# EAGLE design DigitalBackend_v1 (EAGLE 9.6.2)

## Sheet 1 of 6: MAIN
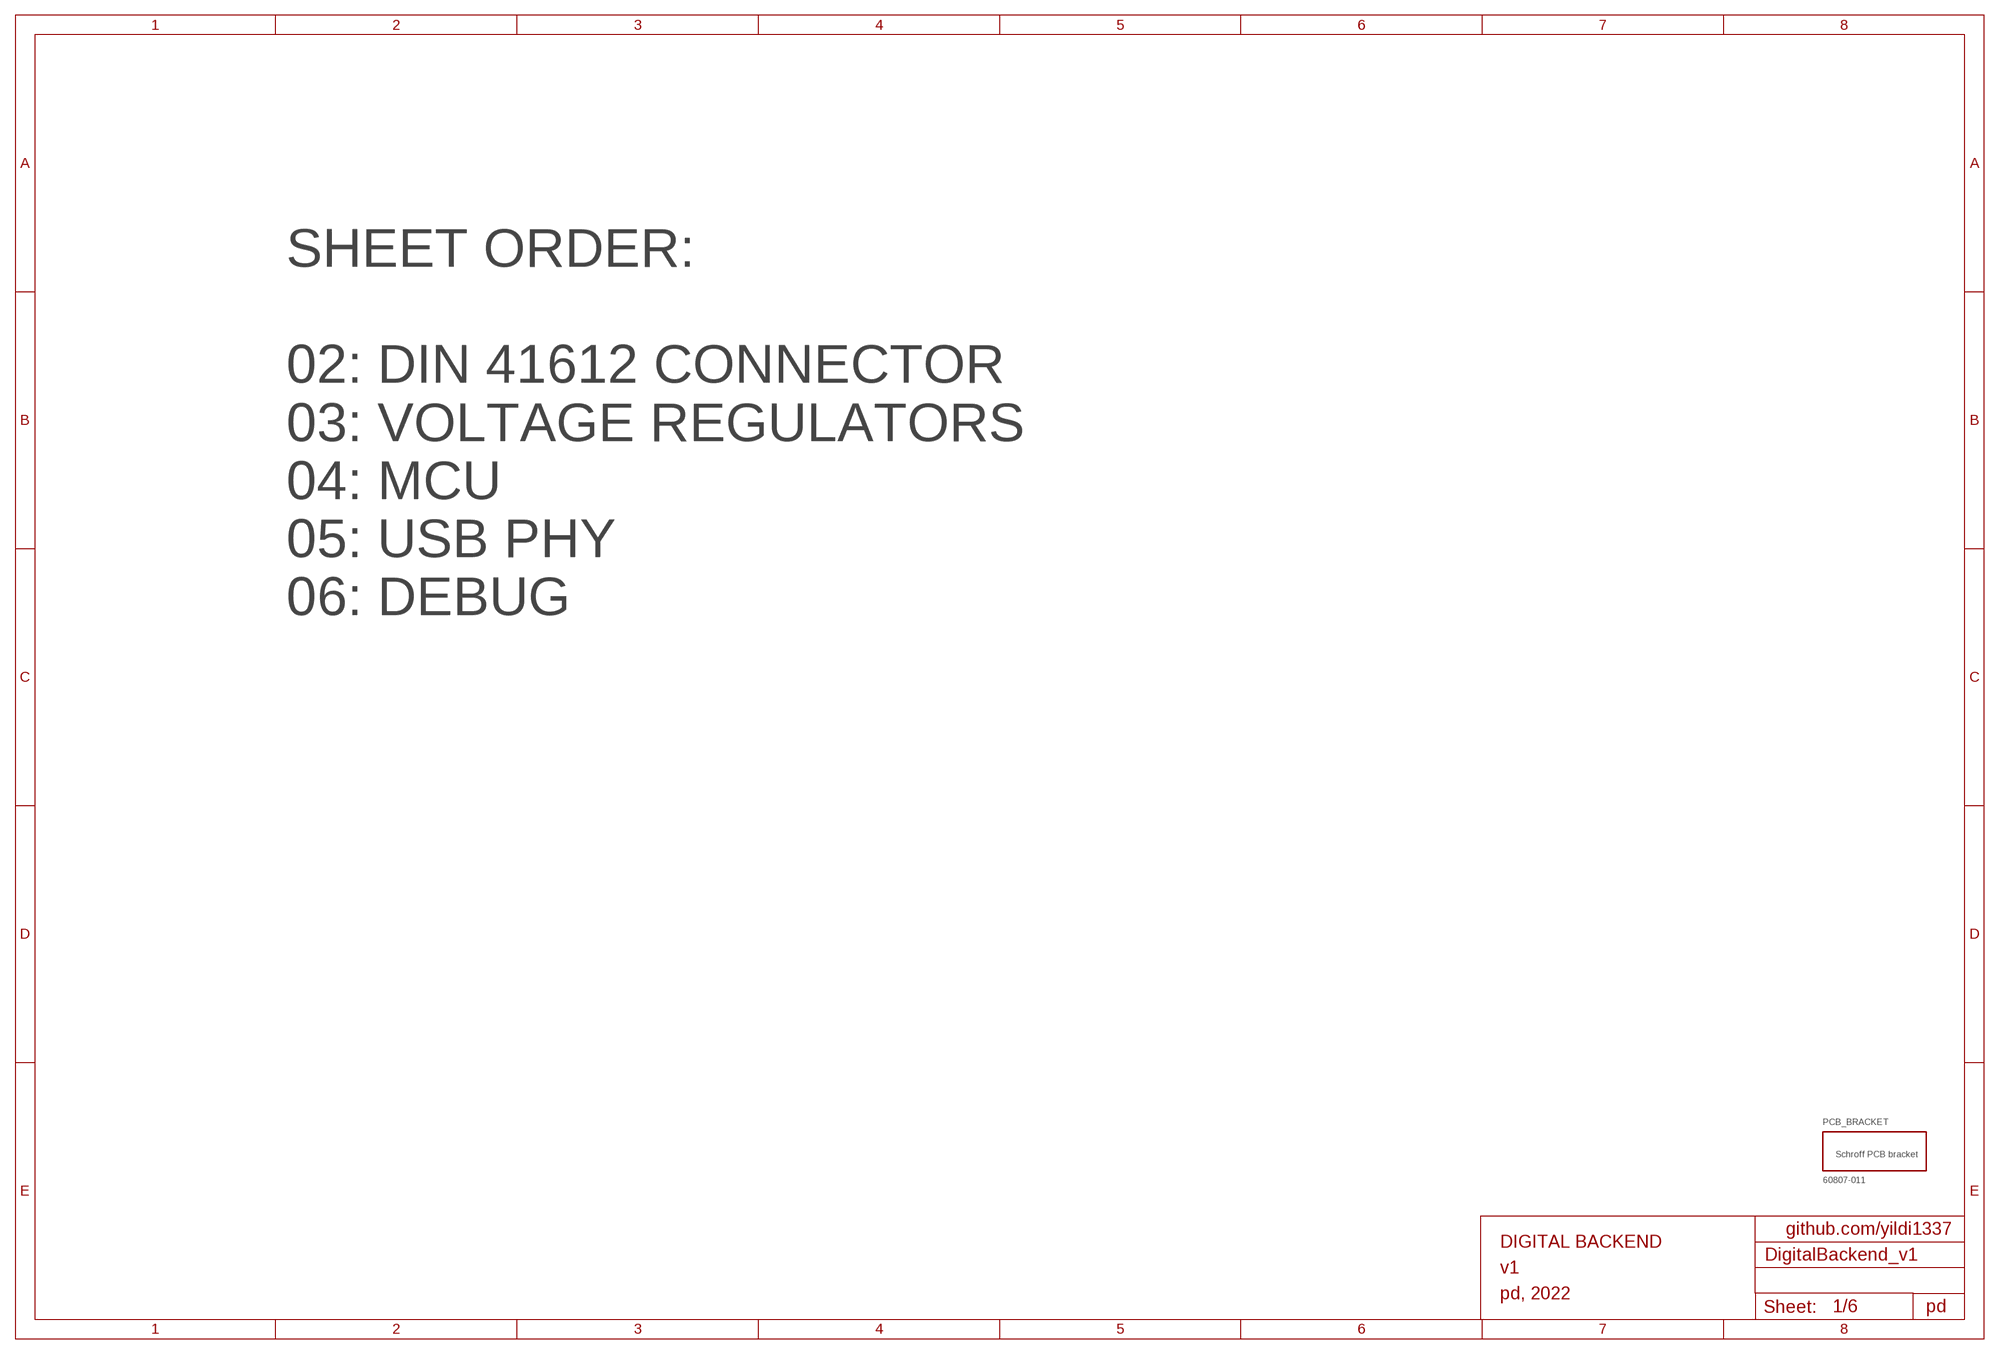
[diagram p0: schematic, sheet 1]

### Parts
PCB_BRACKET  60807-011  [60807-011]

### Notes on the sheet
- SHEET ORDER:
  
  02: DIN 41612 CONNECTOR
  03: VOLTAGE REGULATORS
  04: MCU
  05: USB PHY
  06: DEBUG
- github.com/yildi1337
- DIGITAL BACKEND
- v1
- pd, 2022
- pd

## Sheet 2 of 6: DIN 41612 CONNECTOR
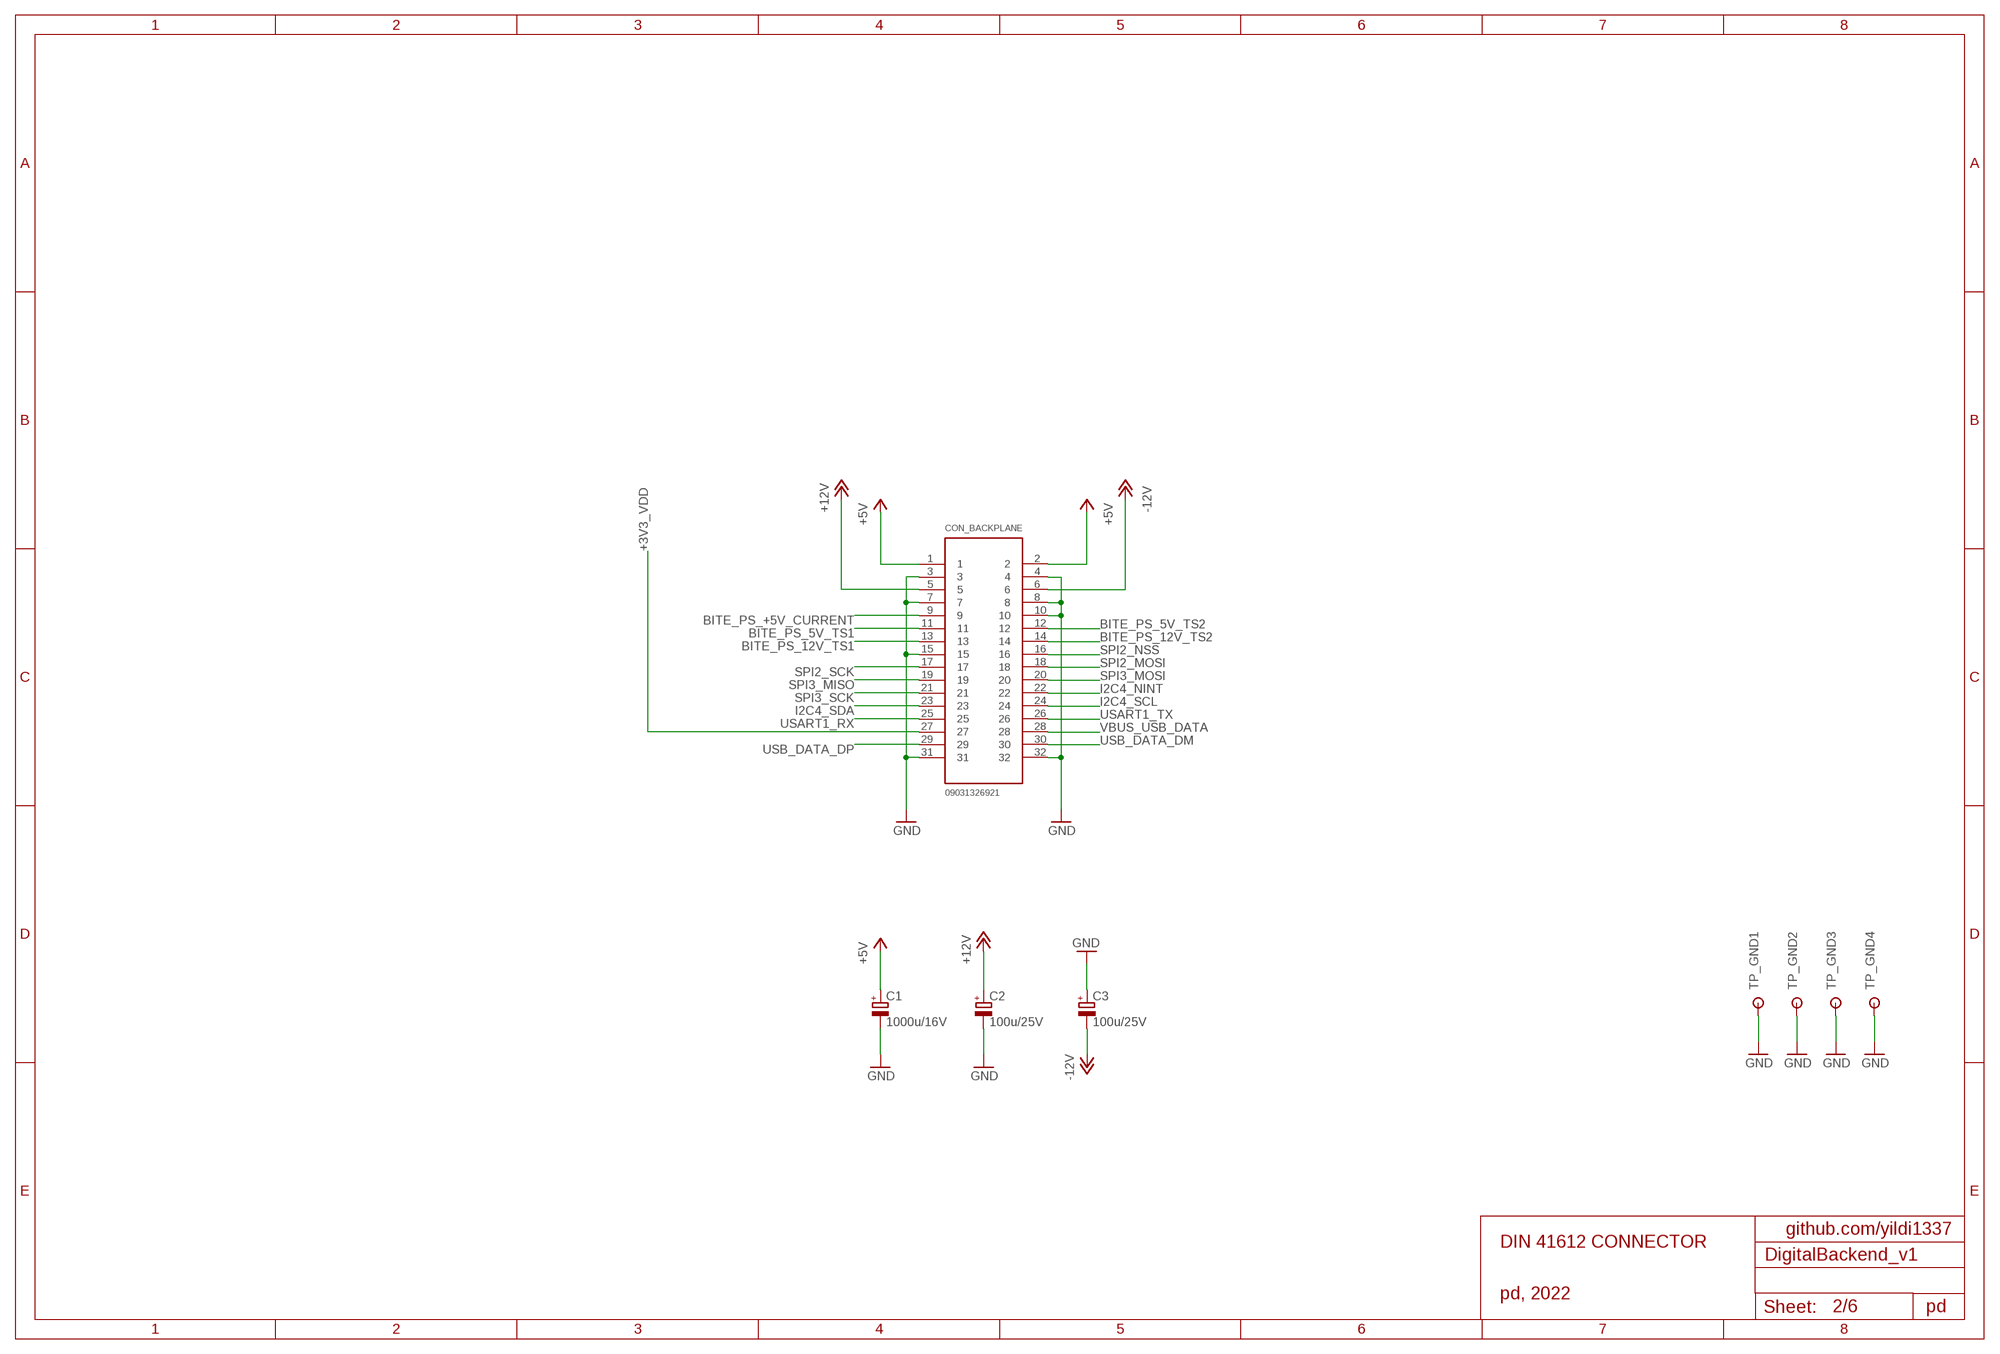
[diagram p1: schematic, sheet 2]

### Parts
C1  1000u/16V  CPOL-EU153CLV-1010  [153CLV-1010]
C2  100u/25V  CPOL-EU153CLV-0810  [153CLV-0810]
C3  100u/25V  CPOL-EU153CLV-0810  [153CLV-0810]
CON_BACKPLANE  09031326921  [09031326921]
TP_GND1  RSPRO-1MM-TERMINAL-POST-2622034  [RSPRO-1MM-TERMINAL-POST-2622034]
TP_GND2  RSPRO-1MM-TERMINAL-POST-2622034  [RSPRO-1MM-TERMINAL-POST-2622034]
TP_GND3  RSPRO-1MM-TERMINAL-POST-2622034  [RSPRO-1MM-TERMINAL-POST-2622034]
TP_GND4  RSPRO-1MM-TERMINAL-POST-2622034  [RSPRO-1MM-TERMINAL-POST-2622034]

### Nets
+3V3_VDD: CON_BACKPLANE.27 ; also sheet 3,4,5,6
+5V: C1.+ CON_BACKPLANE.1 CON_BACKPLANE.2 ; also sheet 3
+12V: C2.+ CON_BACKPLANE.5 ; also sheet 3
-12V: C3.- CON_BACKPLANE.6
BITE_PS_5V_TS1: CON_BACKPLANE.11
BITE_PS_5V_TS2: CON_BACKPLANE.12
BITE_PS_12V_TS1: CON_BACKPLANE.13
BITE_PS_12V_TS2: CON_BACKPLANE.14
BITE_PS_+5V_CURRENT: CON_BACKPLANE.9
GND: C1.- C2.- C3.+ CON_BACKPLANE.3 CON_BACKPLANE.4 CON_BACKPLANE.7 CON_BACKPLANE.8 CON_BACKPLANE.10 CON_BACKPLANE.15 CON_BACKPLANE.31 CON_BACKPLANE.32 TP_GND1.P$1 TP_GND2.P$1 TP_GND3.P$1 TP_GND4.P$1 ; also sheet 3,4,5,6
I2C4_NINT: CON_BACKPLANE.22 ; also sheet 4
I2C4_SCL: CON_BACKPLANE.24 ; also sheet 4
I2C4_SDA: CON_BACKPLANE.23 ; also sheet 4
SPI2_MOSI: CON_BACKPLANE.18 ; also sheet 4
SPI2_NSS: CON_BACKPLANE.16 ; also sheet 4
SPI2_SCK: CON_BACKPLANE.17 ; also sheet 4
SPI3_MISO: CON_BACKPLANE.19 ; also sheet 4
SPI3_MOSI: CON_BACKPLANE.20 ; also sheet 4
SPI3_SCK: CON_BACKPLANE.21 ; also sheet 4
USART1_RX: CON_BACKPLANE.25 ; also sheet 4
USART1_TX: CON_BACKPLANE.26 ; also sheet 4
USB_DATA_DM: CON_BACKPLANE.30 ; also sheet 5
USB_DATA_DP: CON_BACKPLANE.29 ; also sheet 5
VBUS_USB_DATA: CON_BACKPLANE.28 ; also sheet 5

### Notes on the sheet
- github.com/yildi1337
- DIN 41612 CONNECTOR
- pd, 2022
- pd

## Sheet 3 of 6: VOLTAGE REGULATORS
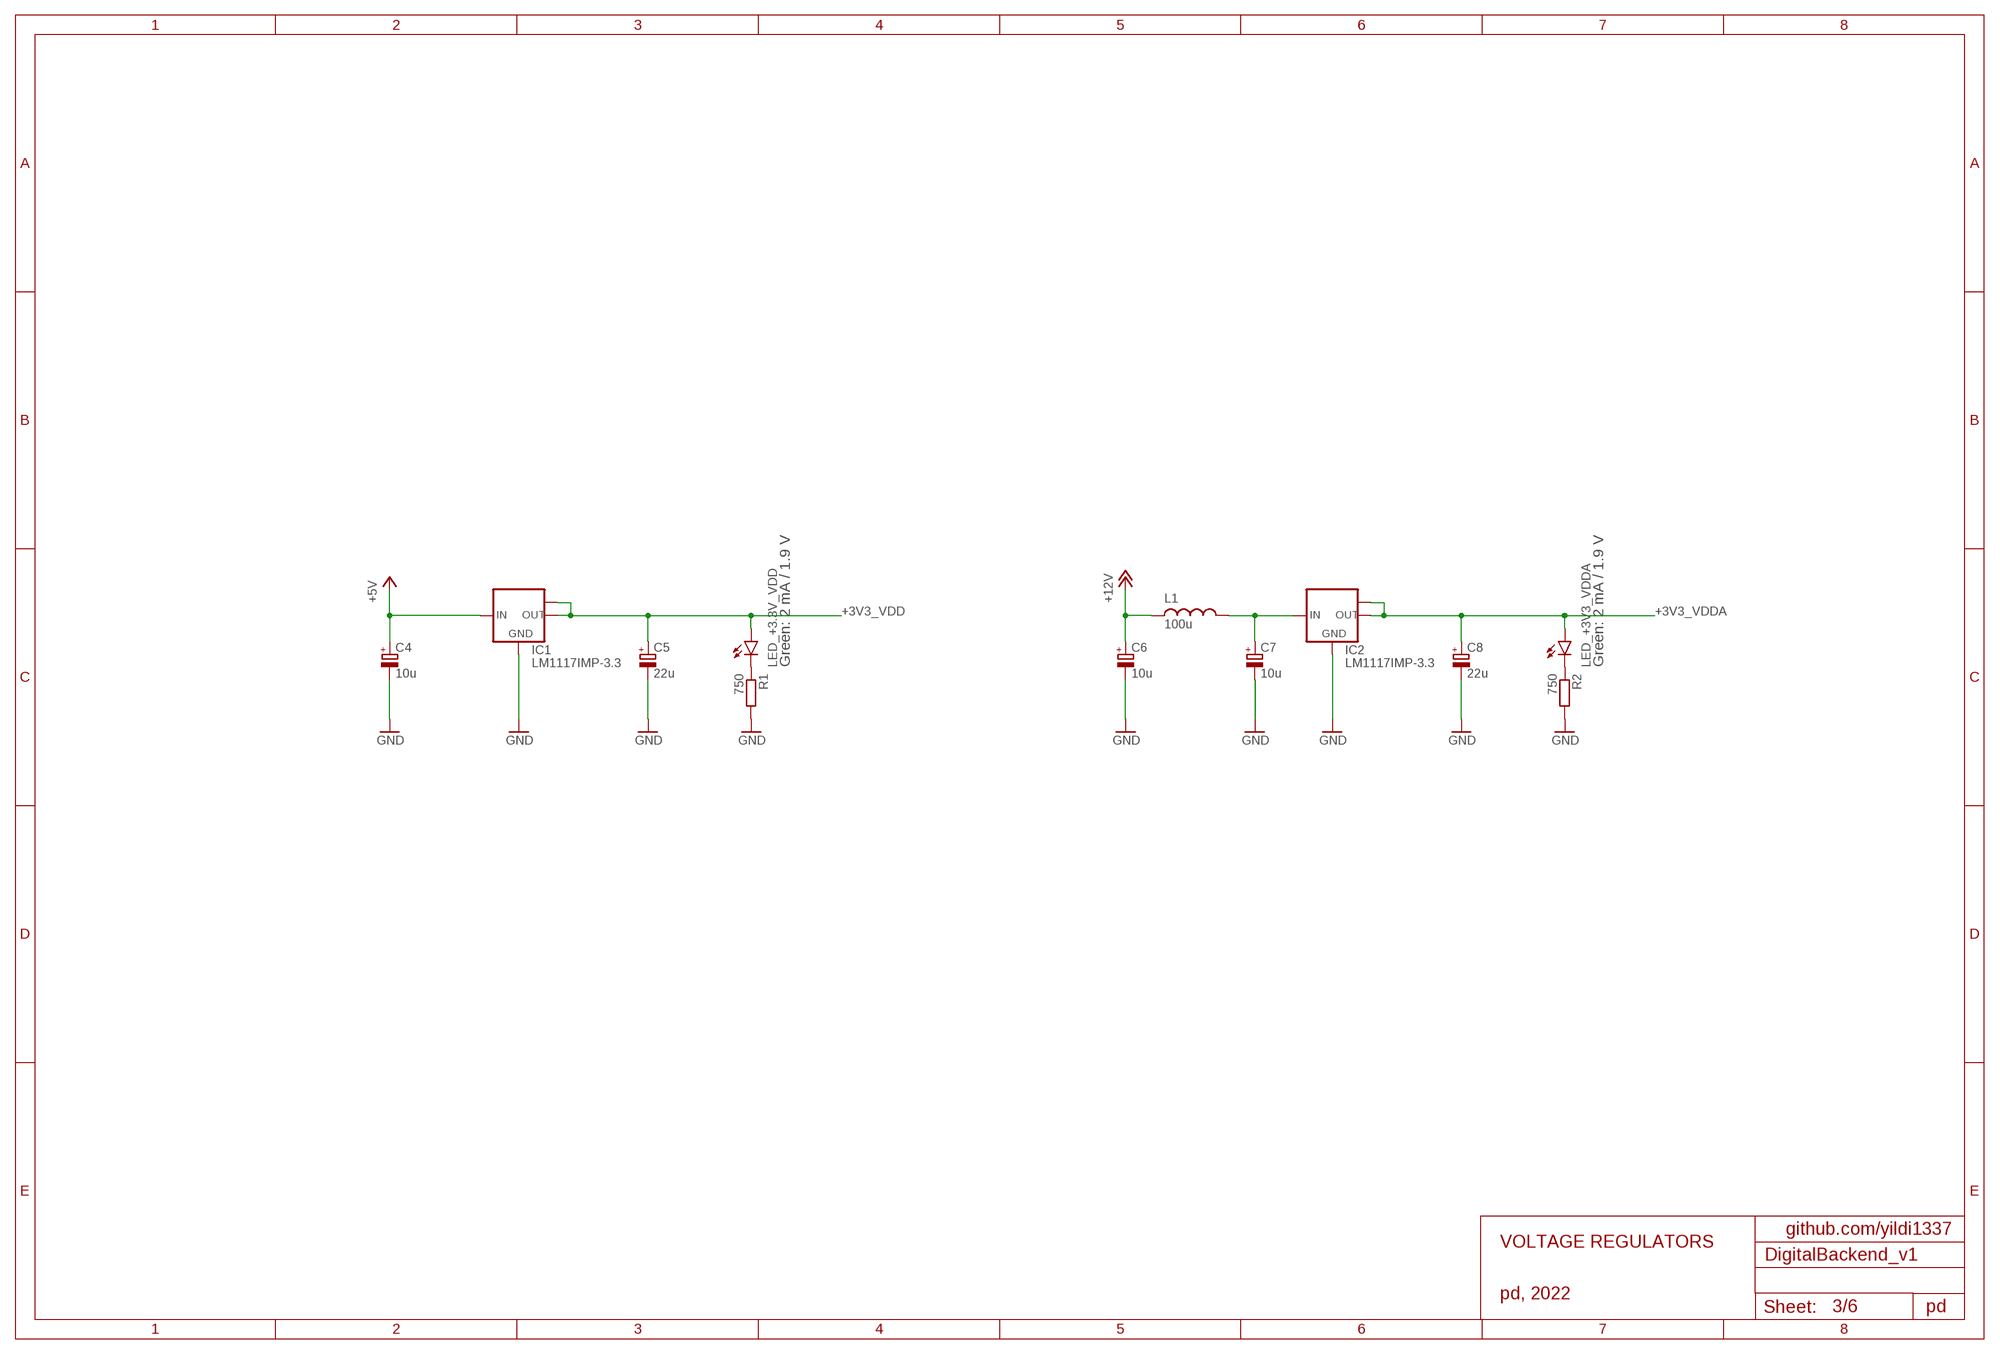
[diagram p2: schematic, sheet 3]

### Parts
C4  10u  CPOL-EUCT3216  [CT3216]
C5  22u  CPOL-EUCT6032  [CT6032]
C6  10u  CPOL-EUCT3216  [CT3216]
C7  10u  CPOL-EUCT3216  [CT3216]
C8  22u  CPOL-EUCT6032  [CT6032]
IC1  LM1117IMP-3.3  LM1117IMPX-3.3  [SOT223]
IC2  LM1117IMP-3.3  LM1117IMPX-3.3  [SOT223]
L1  100u  VLS6045AF-101M  [VLS6045AF-101M]
LED_+3.3V_VDD  LEDCHIP-LED0603  [CHIP-LED0603]
LED_+3V3_VDDA  LEDCHIP-LED0603  [CHIP-LED0603]
R1  750  R-EU_R0603  [R0603]
R2  750  R-EU_R0603  [R0603]

### Nets
+3V3_VDD: C5.+ IC1.2(OUT) IC1.TAB(OUT1) LED_+3.3V_VDD.A ; also sheet 2,4,5,6
+3V3_VDDA: C8.+ IC2.2(OUT) IC2.TAB(OUT1) LED_+3V3_VDDA.A ; also sheet 4
+5V: C4.+ IC1.3(IN) ; also sheet 2
+12V: C6.+ L1.1 ; also sheet 2
GND: C4.- C5.- C6.- C7.- C8.- IC1.1(GND) IC2.1(GND) R1.2 R2.2 ; also sheet 2,4,5,6
N$4: C7.+ IC2.3(IN) L1.2
N$49: LED_+3.3V_VDD.C R1.1
N$50: LED_+3V3_VDDA.C R2.1

### Notes on the sheet
- Green: 2 mA / 1.9 V | Green: 2 mA / 1.9 V
- github.com/yildi1337
- VOLTAGE REGULATORS
- pd, 2022
- pd

## Sheet 4 of 6: MCU
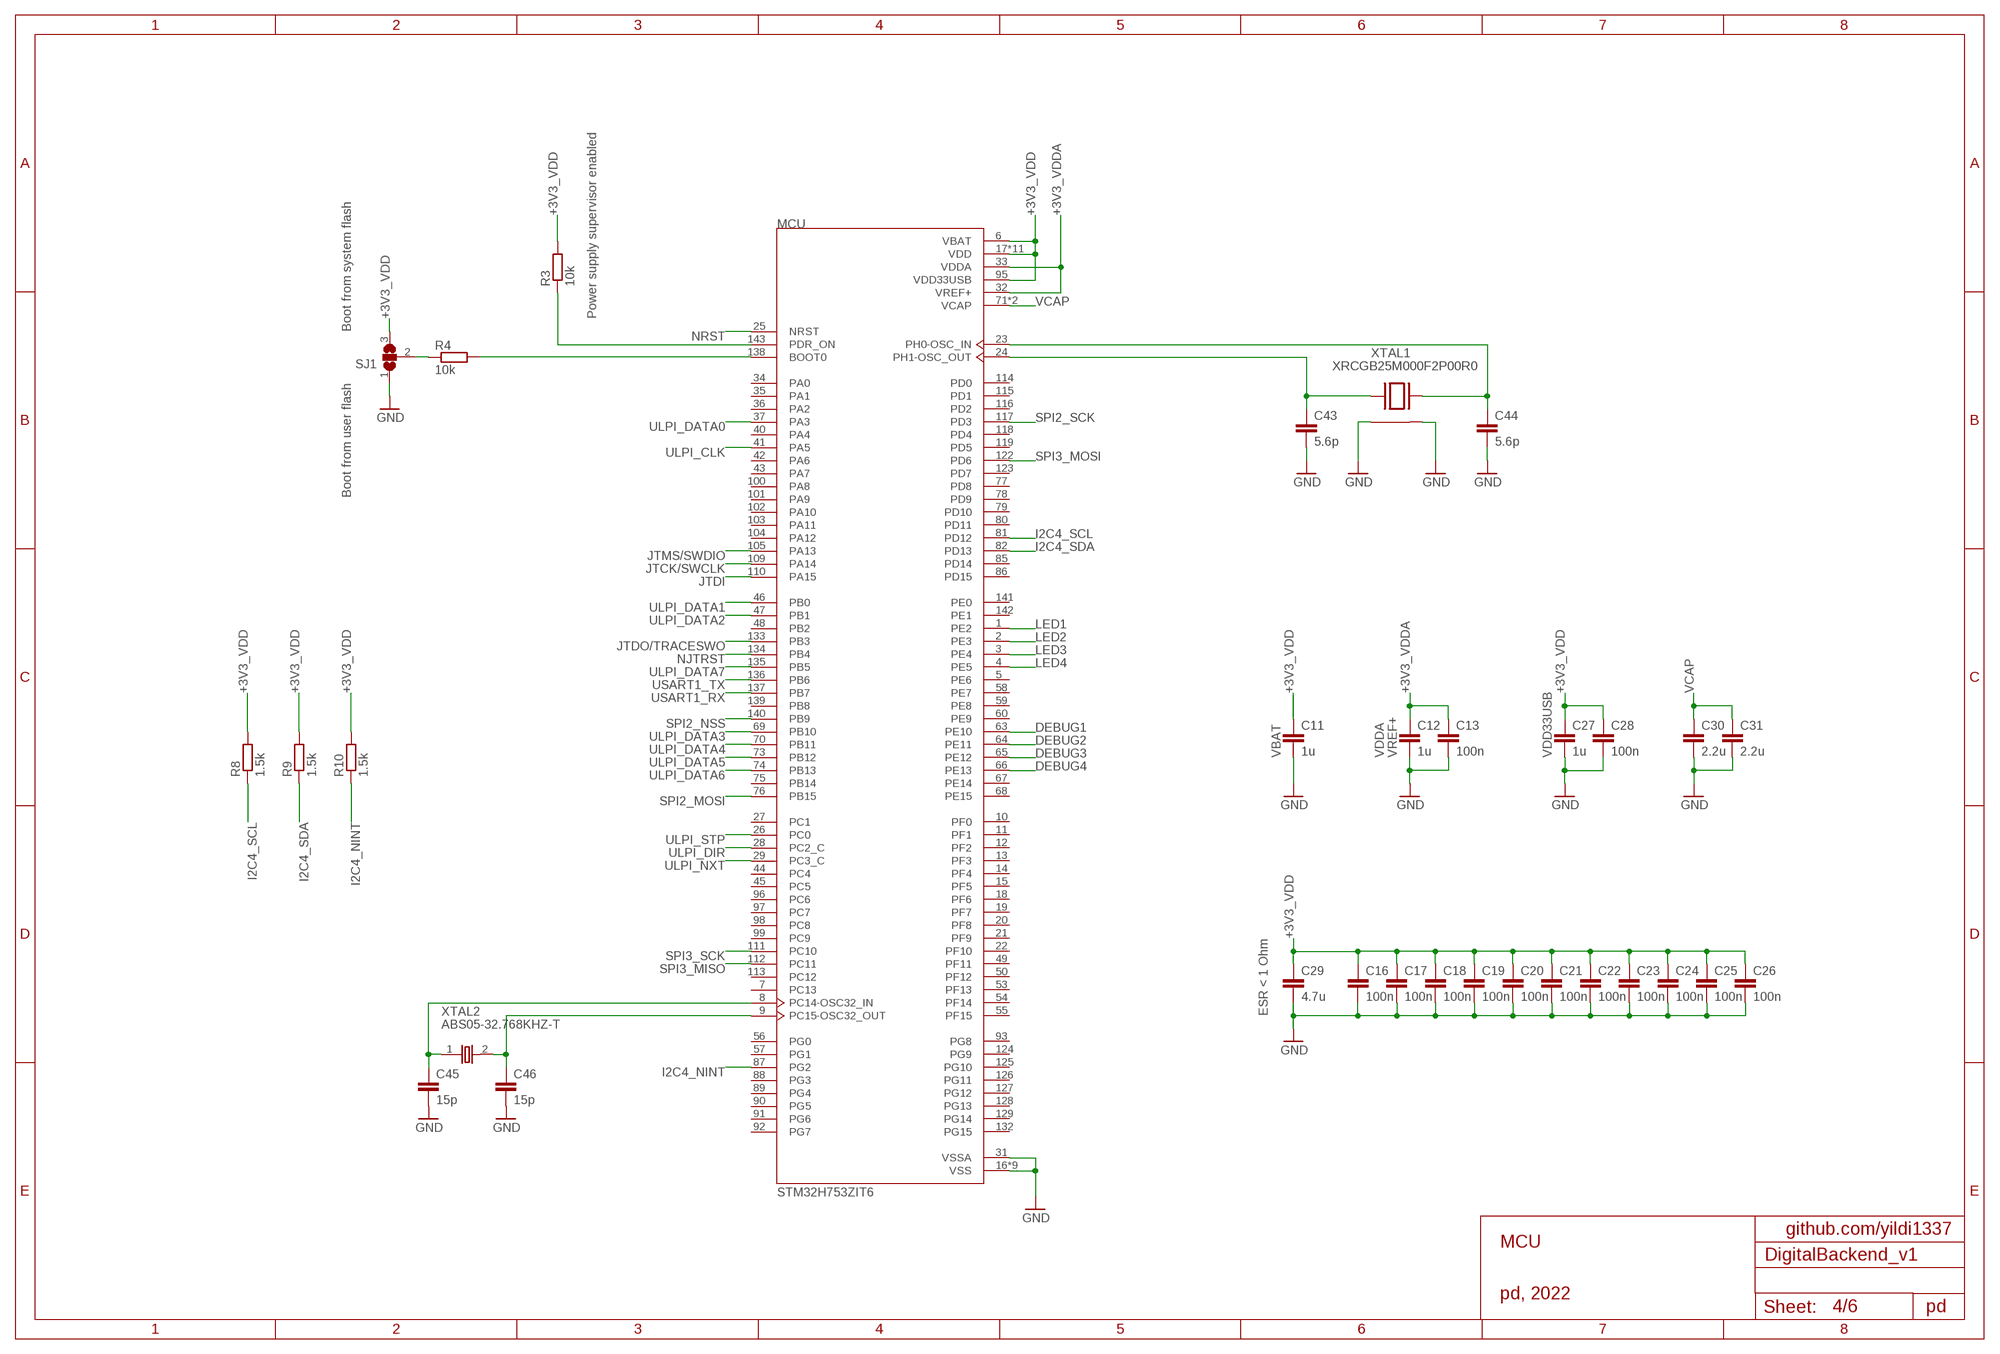
[diagram p3: schematic, sheet 4]

### Parts
C11  1u  C-EUC0603  [C0603]
C12  1u  C-EUC0603  [C0603]
C13  100n  C-EUC0603  [C0603]
C16  100n  C-EUC0603  [C0603]
C17  100n  C-EUC0603  [C0603]
C18  100n  C-EUC0603  [C0603]
C19  100n  C-EUC0603  [C0603]
C20  100n  C-EUC0603  [C0603]
C21  100n  C-EUC0603  [C0603]
C22  100n  C-EUC0603  [C0603]
C23  100n  C-EUC0603  [C0603]
C24  100n  C-EUC0603  [C0603]
C25  100n  C-EUC0603  [C0603]
C26  100n  C-EUC0603  [C0603]
C27  1u  C-EUC0603  [C0603]
C28  100n  C-EUC0603  [C0603]
C29  4.7u  C-EUC0603  [C0603]
C30  2.2u  C-EUC0603  [C0603]
C31  2.2u  C-EUC0603  [C0603]
C43  5.6p  C-EUC0603  [C0603]
C44  5.6p  C-EUC0603  [C0603]
C45  15p  C-EUC0603  [C0603]
C46  15p  C-EUC0603  [C0603]
MCU  STM32H753ZIT6  [LQFP144]
R3  10k  R-EU_R0603  [R0603]
R4  10k  R-EU_R0603  [R0603]
R8  1.5k  R-EU_R0603  [R0603]
R9  1.5k  R-EU_R0603  [R0603]
R10  1.5k  R-EU_R0603  [R0603]
SJ1  SJ2W  [SJ_2]
XTAL1  XRCGB25M000F2P00R0  [XRCGB25M000F2P00R0]
XTAL2  ABS05-32.768KHZ-T  [ABS05-32.768KHZ-T]

### Nets
+3V3_VDD: C11.1 C16.1 C17.1 C18.1 C19.1 C20.1 C21.1 C22.1 C23.1 C24.1 C25.1 C26.1 C27.1 C28.1 C29.1 MCU.6(VBAT) MCU.17(VDD) MCU.30(VDD) MCU.39(VDD) MCU.52(VDD) MCU.62(VDD) MCU.72(VDD) MCU.84(VDD) MCU.95(VDD33USB) MCU.108(VDD) MCU.121(VDD) MCU.131(VDD) MCU.144(VDD) R3.2 R8.2 R9.2 R10.2 SJ1.3 ; also sheet 2,3,5,6
+3V3_VDDA: C12.1 C13.1 MCU.32(VREF+) MCU.33(VDDA) ; also sheet 3
DEBUG1: MCU.63(PE10) ; also sheet 6
DEBUG2: MCU.64(PE11) ; also sheet 6
DEBUG3: MCU.65(PE12) ; also sheet 6
DEBUG4: MCU.66(PE13) ; also sheet 6
GND: C11.2 C12.2 C13.2 C16.2 C17.2 C18.2 C19.2 C20.2 C21.2 C22.2 C23.2 C24.2 C25.2 C26.2 C27.2 C28.2 C29.2 C30.2 C31.2 C43.2 C44.2 C45.2 C46.2 MCU.16(VSS) MCU.31(VSSA) MCU.38(VSS) MCU.51(VSS) MCU.61(VSS) MCU.83(VSS) MCU.94(VSS) MCU.107(VSS) MCU.120(VSS) MCU.130(VSS) SJ1.1 XTAL1.2(GND2) XTAL1.4(GND4) ; also sheet 2,3,5,6
I2C4_NINT: MCU.87(PG2) R10.1 ; also sheet 2
I2C4_SCL: MCU.81(PD12) R8.1 ; also sheet 2
I2C4_SDA: MCU.82(PD13) R9.1 ; also sheet 2
JTCK/SWCLK: MCU.109(PA14) ; also sheet 6
JTDI: MCU.110(PA15) ; also sheet 6
JTDO/TRACESWO: MCU.133(PB3) ; also sheet 6
JTMS/SWDIO: MCU.105(PA13) ; also sheet 6
LED1: MCU.1(PE2) ; also sheet 6
LED2: MCU.2(PE3) ; also sheet 6
LED3: MCU.3(PE4) ; also sheet 6
LED4: MCU.4(PE5) ; also sheet 6
N$2: MCU.143(PDR_ON) R3.1
N$3: MCU.138(BOOT0) R4.2
N$5: R4.1 SJ1.2
N$9: C45.1 MCU.8(PC14-OSC32_IN) XTAL2.1
N$10: C44.1 MCU.23(PH0-OSC_IN) XTAL1.3
N$11: C43.1 MCU.24(PH1-OSC_OUT) XTAL1.1
N$28: C46.1 MCU.9(PC15-OSC32_OUT) XTAL2.2
NJTRST: MCU.134(PB4) ; also sheet 6
NRST: MCU.25(NRST) ; also sheet 6
SPI2_MOSI: MCU.76(PB15) ; also sheet 2
SPI2_NSS: MCU.140(PB9) ; also sheet 2
SPI2_SCK: MCU.117(PD3) ; also sheet 2
SPI3_MISO: MCU.112(PC11) ; also sheet 2
SPI3_MOSI: MCU.122(PD6) ; also sheet 2
SPI3_SCK: MCU.111(PC10) ; also sheet 2
ULPI_CLK: MCU.41(PA5) ; also sheet 5
ULPI_DATA0: MCU.37(PA3) ; also sheet 5
ULPI_DATA1: MCU.46(PB0) ; also sheet 5
ULPI_DATA2: MCU.47(PB1) ; also sheet 5
ULPI_DATA3: MCU.69(PB10) ; also sheet 5
ULPI_DATA4: MCU.70(PB11) ; also sheet 5
ULPI_DATA5: MCU.73(PB12) ; also sheet 5
ULPI_DATA6: MCU.74(PB13) ; also sheet 5
ULPI_DATA7: MCU.135(PB5) ; also sheet 5
ULPI_DIR: MCU.28(PC2_C) ; also sheet 5
ULPI_NXT: MCU.29(PC3_C) ; also sheet 5
ULPI_STP: MCU.26(PC0) ; also sheet 5
USART1_RX: MCU.137(PB7) ; also sheet 2
USART1_TX: MCU.136(PB6) ; also sheet 2
VCAP: C30.1 C31.1 MCU.71(VCAP) MCU.106(VCAP)
Unconnected: MCU.5(PE6) MCU.7(PC13) MCU.10(PF0) MCU.11(PF1) MCU.12(PF2) MCU.13(PF3) MCU.14(PF4) MCU.15(PF5) MCU.18(PF6) MCU.19(PF7) MCU.20(PF8) MCU.21(PF9) MCU.22(PF10) MCU.27(PC1) MCU.34(PA0) MCU.35(PA1) MCU.36(PA2) MCU.40(PA4) MCU.42(PA6) MCU.43(PA7) MCU.44(PC4) MCU.45(PC5) MCU.48(PB2) MCU.49(PF11) MCU.50(PF12) MCU.53(PF13) MCU.54(PF14) MCU.55(PF15) MCU.56(PG0) MCU.57(PG1) MCU.58(PE7) MCU.59(PE8) MCU.60(PE9) MCU.67(PE14) MCU.68(PE15) MCU.75(PB14) MCU.77(PD8) MCU.78(PD9) MCU.79(PD10) MCU.80(PD11) MCU.85(PD14) MCU.86(PD15) MCU.88(PG3) MCU.89(PG4) MCU.90(PG5) MCU.91(PG6) MCU.92(PG7) MCU.93(PG8) MCU.96(PC6) MCU.97(PC7) MCU.98(PC8) MCU.99(PC9) MCU.100(PA8) MCU.101(PA9) MCU.102(PA10) MCU.103(PA11) MCU.104(PA12) MCU.113(PC12) MCU.114(PD0) MCU.115(PD1) MCU.116(PD2) MCU.118(PD4) MCU.119(PD5) MCU.123(PD7) MCU.124(PG9) MCU.125(PG10) MCU.126(PG11) MCU.127(PG12) MCU.128(PG13) MCU.129(PG14) MCU.132(PG15) MCU.139(PB8) MCU.141(PE0) MCU.142(PE1)

### Notes on the sheet
- Power supply supervisor enabled
- Boot from system flash
- Boot from user flash
- VBAT | VDDA | VREF+ | VDD33USB
- ESR < 1 Ohm
- github.com/yildi1337
- MCU
- pd, 2022
- pd

## Sheet 5 of 6: USB PHY
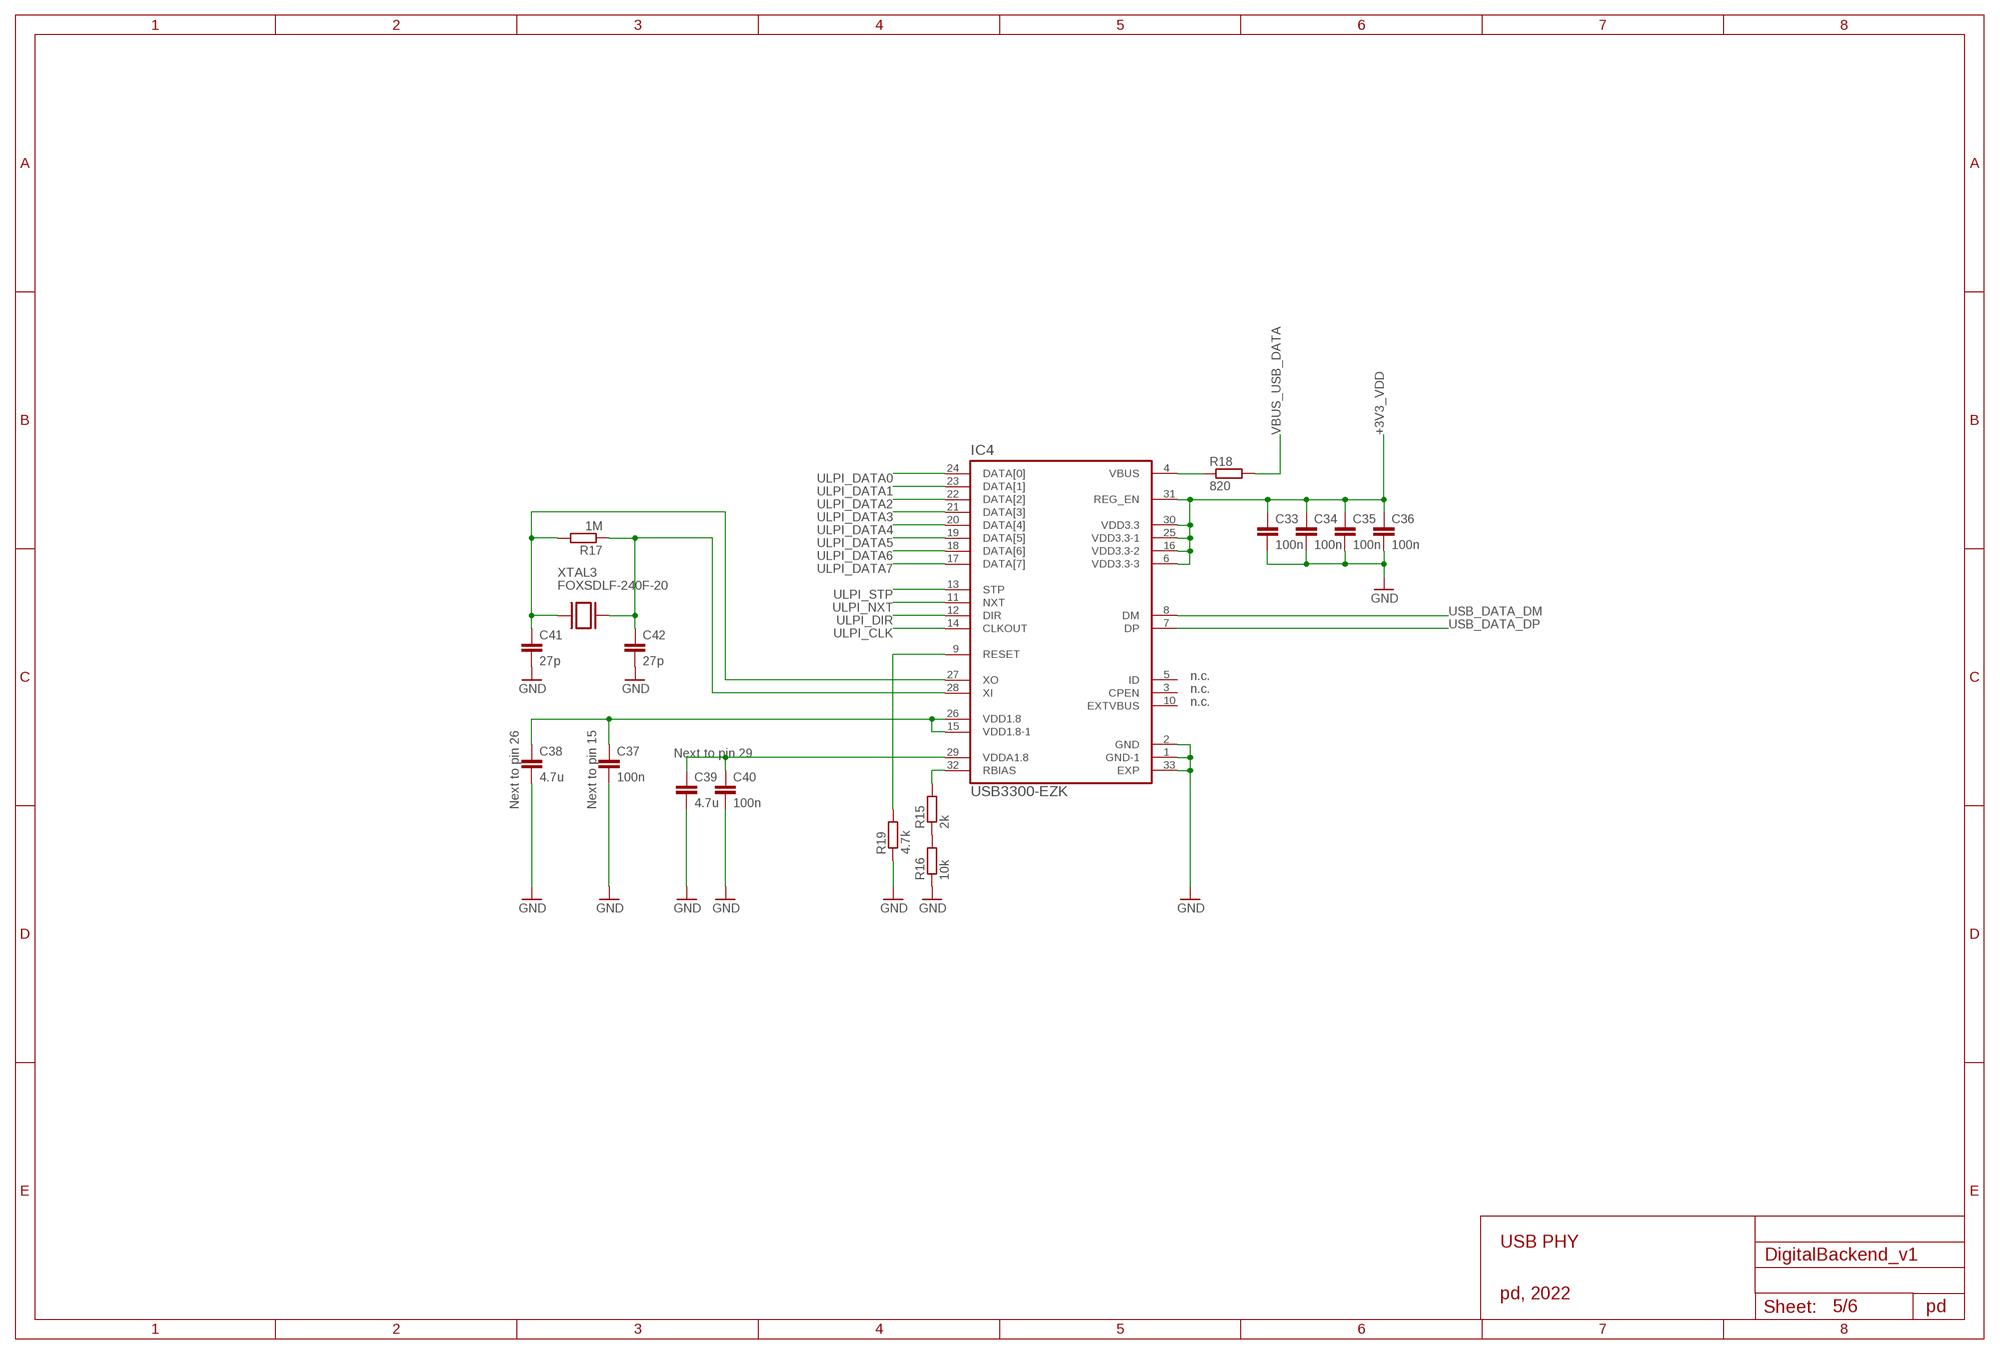
[diagram p4: schematic, sheet 5]

### Parts
C33  100n  C-EUC0603  [C0603]
C34  100n  C-EUC0603  [C0603]
C35  100n  C-EUC0603  [C0603]
C36  100n  C-EUC0603  [C0603]
C37  100n  C-EUC0603  [C0603]
C38  4.7u  C-EUC0603  [C0603]
C39  4.7u  C-EUC0603  [C0603]
C40  100n  C-EUC0603  [C0603]
C41  27p  C-EUC0603  [C0603]
C42  27p  C-EUC0603  [C0603]
IC4  USB3300-EZK  [USB3300-EZK]
R15  2k  R-EU_R0603  [R0603]
R16  10k  R-EU_R0603  [R0603]
R17  1M  R-EU_R0603  [R0603]
R18  820  R-EU_R0603  [R0603]
R19  4.7k  R-EU_R0603  [R0603]
XTAL3  FOXSDLF-240F-20  [FOXSDLF-240F-20]

### Nets
+3V3_VDD: C33.1 C34.1 C35.1 C36.1 IC4.6(VDD3.3-3) IC4.16(VDD3.3-2) IC4.25(VDD3.3-1) IC4.30(VDD3.3) IC4.31(REG_EN) ; also sheet 2,3,4,6
GND: C33.2 C34.2 C35.2 C36.2 C37.2 C38.2 C39.2 C40.2 C41.2 C42.2 IC4.1(GND-1) IC4.2(GND) IC4.33(EXP) R16.1 R19.1 ; also sheet 2,3,4,6
N$1: C37.1 C38.1 IC4.15(VDD1.8-1) IC4.26(VDD1.8)
N$12: C39.1 C40.1 IC4.29(VDDA1.8)
N$18: R15.1 R16.2
N$22: IC4.32(RBIAS) R15.2
N$23: C41.1 IC4.27(XO) R17.2 XTAL3.1
N$24: C42.1 IC4.28(XI) R17.1 XTAL3.2
N$25: IC4.4(VBUS) R18.1
N$26: IC4.9(RESET) R19.2
ULPI_CLK: IC4.14(CLKOUT) ; also sheet 4
ULPI_DATA0: IC4.24(DATA[0]) ; also sheet 4
ULPI_DATA1: IC4.23(DATA[1]) ; also sheet 4
ULPI_DATA2: IC4.22(DATA[2]) ; also sheet 4
ULPI_DATA3: IC4.21(DATA[3]) ; also sheet 4
ULPI_DATA4: IC4.20(DATA[4]) ; also sheet 4
ULPI_DATA5: IC4.19(DATA[5]) ; also sheet 4
ULPI_DATA6: IC4.18(DATA[6]) ; also sheet 4
ULPI_DATA7: IC4.17(DATA[7]) ; also sheet 4
ULPI_DIR: IC4.12(DIR) ; also sheet 4
ULPI_NXT: IC4.11(NXT) ; also sheet 4
ULPI_STP: IC4.13(STP) ; also sheet 4
USB_DATA_DM: IC4.8(DM) ; also sheet 2
USB_DATA_DP: IC4.7(DP) ; also sheet 2
VBUS_USB_DATA: R18.2 ; also sheet 2
Unconnected: IC4.3(CPEN) IC4.5(ID) IC4.10(EXTVBUS)

### Notes on the sheet
- n.c.
- n.c.
- n.c.
- Next to pin 29
- Next to pin 26 | Next to pin 15
- USB PHY
- pd, 2022
- pd

## Sheet 6 of 6: DEBUG
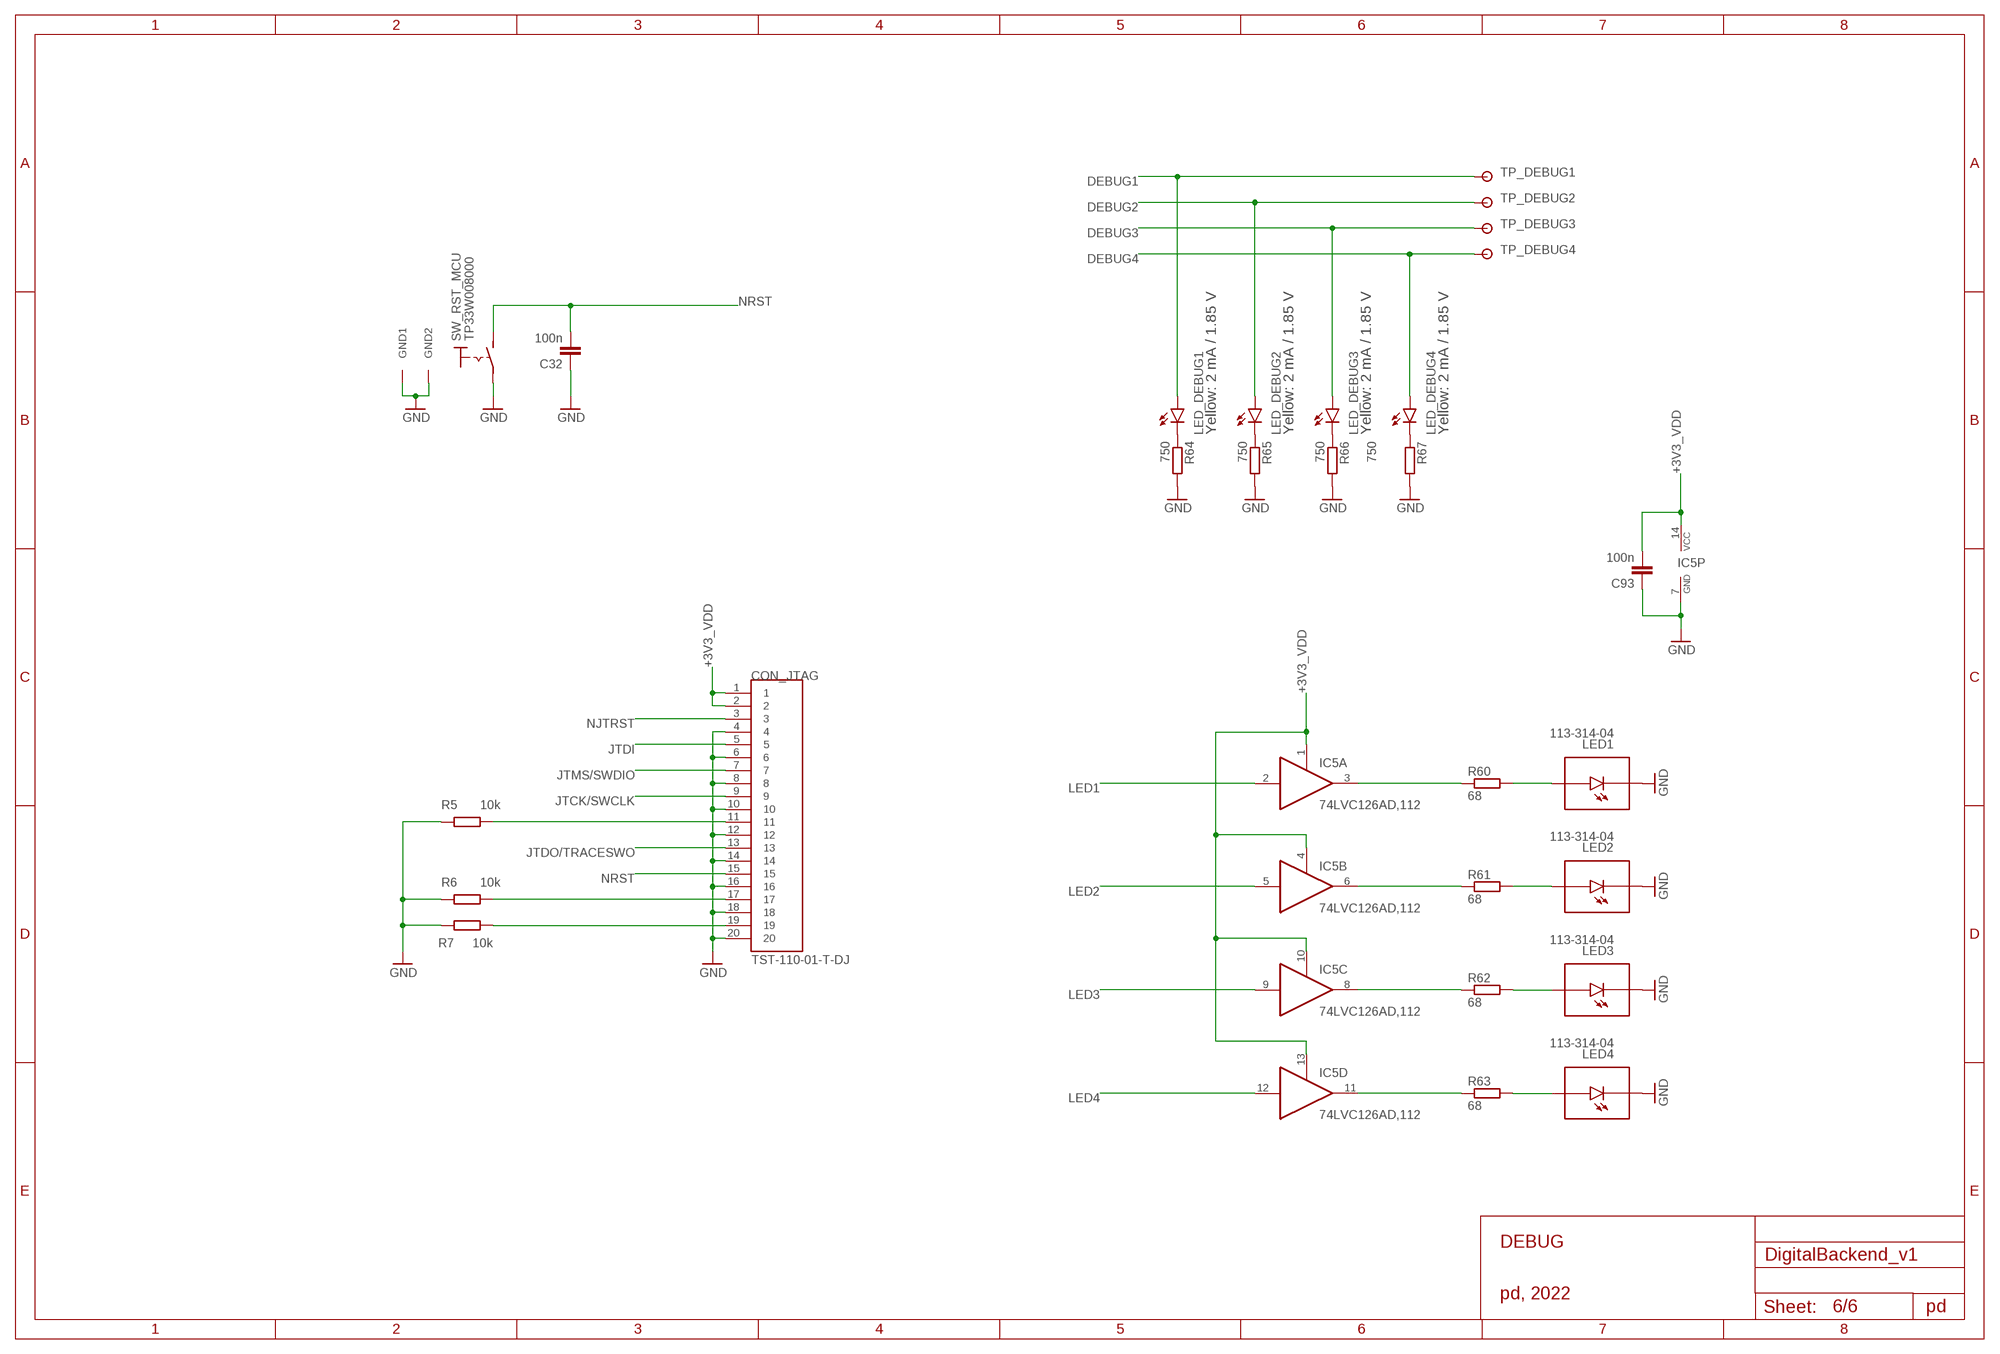
[diagram p5: schematic, sheet 6]

### Parts
C32  100n  C-EUC0603  [C0603]
C93  100n  C-EUC0603  [C0603]
CON_JTAG  TST-110-01-T-DJ  [TST-110-01-T-D]
IC5  74LVC126AD,112  74AC126D  [SO14]
LED1  113-314-04  [113-314-04]
LED2  113-314-04  [113-314-04]
LED3  113-314-04  [113-314-04]
LED4  113-314-04  [113-314-04]
LED_DEBUG1  LEDCHIP-LED0603  [CHIP-LED0603]
LED_DEBUG2  LEDCHIP-LED0603  [CHIP-LED0603]
LED_DEBUG3  LEDCHIP-LED0603  [CHIP-LED0603]
LED_DEBUG4  LEDCHIP-LED0603  [CHIP-LED0603]
R5  10k  R-EU_R0603  [R0603]
R6  10k  R-EU_R0603  [R0603]
R7  10k  R-EU_R0603  [R0603]
R60  68  R-EU_R0603  [R0603]
R61  68  R-EU_R0603  [R0603]
R62  68  R-EU_R0603  [R0603]
R63  68  R-EU_R0603  [R0603]
R64  750  R-EU_R0603  [R0603]
R65  750  R-EU_R0603  [R0603]
R66  750  R-EU_R0603  [R0603]
R67  750  R-EU_R0603  [R0603]
SW_RST_MCU  TP33W008000  [TP33W008000]
TP_DEBUG1  RSPRO-1MM-TERMINAL-POST-2622034  [RSPRO-1MM-TERMINAL-POST-2622034]
TP_DEBUG2  RSPRO-1MM-TERMINAL-POST-2622034  [RSPRO-1MM-TERMINAL-POST-2622034]
TP_DEBUG3  RSPRO-1MM-TERMINAL-POST-2622034  [RSPRO-1MM-TERMINAL-POST-2622034]
TP_DEBUG4  RSPRO-1MM-TERMINAL-POST-2622034  [RSPRO-1MM-TERMINAL-POST-2622034]

### Nets
+3V3_VDD: C93.2 CON_JTAG.1 CON_JTAG.2 IC5.1(A:OE) IC5.4(B:OE) IC5.10(C:OE) IC5.13(D:OE) IC5.14(P:VCC) ; also sheet 2,3,4,5
DEBUG1: LED_DEBUG1.A TP_DEBUG1.P$1 ; also sheet 4
DEBUG2: LED_DEBUG2.A TP_DEBUG2.P$1 ; also sheet 4
DEBUG3: LED_DEBUG3.A TP_DEBUG3.P$1 ; also sheet 4
DEBUG4: LED_DEBUG4.A TP_DEBUG4.P$1 ; also sheet 4
GND: C32.1 C93.1 CON_JTAG.4 CON_JTAG.6 CON_JTAG.8 CON_JTAG.10 CON_JTAG.12 CON_JTAG.14 CON_JTAG.16 CON_JTAG.18 CON_JTAG.20 IC5.7(P:GND) LED1.-(C) LED2.-(C) LED3.-(C) LED4.-(C) R5.1 R6.1 R7.1 R64.2 R65.2 R66.2 R67.2 SW_RST_MCU.GND1 SW_RST_MCU.GND2 SW_RST_MCU.P1 ; also sheet 2,3,4,5
JTCK/SWCLK: CON_JTAG.9 ; also sheet 4
JTDI: CON_JTAG.5 ; also sheet 4
JTDO/TRACESWO: CON_JTAG.13 ; also sheet 4
JTMS/SWDIO: CON_JTAG.7 ; also sheet 4
LED1: IC5.2(A:I) ; also sheet 4
LED2: IC5.5(B:I) ; also sheet 4
LED3: IC5.9(C:I) ; also sheet 4
LED4: IC5.12(D:I) ; also sheet 4
N$6: CON_JTAG.19 R7.2
N$7: CON_JTAG.17 R6.2
N$8: CON_JTAG.11 R5.2
N$13: LED1.+(A) R60.2
N$14: LED2.+(A) R61.2
N$15: LED3.+(A) R62.2
N$16: LED4.+(A) R63.2
N$65: IC5.3(A:O) R60.1
N$66: IC5.6(B:O) R61.1
N$67: IC5.8(C:O) R62.1
N$68: IC5.11(D:O) R63.1
N$76: LED_DEBUG1.C R64.1
N$83: LED_DEBUG2.C R65.1
N$84: LED_DEBUG3.C R66.1
N$85: LED_DEBUG4.C R67.1
NJTRST: CON_JTAG.3 ; also sheet 4
NRST: C32.2 CON_JTAG.15 SW_RST_MCU.P3 ; also sheet 4

### Notes on the sheet
- Yellow: 2 mA / 1.85 V | Yellow: 2 mA / 1.85 V | Yellow: 2 mA / 1.85 V | Yellow: 2 mA / 1.85 V
- DEBUG
- pd, 2022
- pd

## Library data of the parts
C1-C3 = rcl:CPOL-EU: POLARIZED CAPACITOR, European symbol; SPICEPREFIX: C
C4-C8 = RCL:CPOL-EU: POLARIZED CAPACITOR, European symbol; SPICEPREFIX: C
C11-C13 C16-C46 C93 = RCL:C-EU: CAPACITOR, European symbol; SPICEPREFIX: C
CON_BACKPLANE = 09031326921:09031326921
CON_JTAG = TST-110-01-T-D:TST-110-01-T-D
IC1 IC2 = LM1117:LM1117IMPX-*
IC4 = USB3300-EZK:USB3300-EZK
IC5 = 74xx-eu:74*126: Quad bus BUFFER, 3-state
L1 = VLS6045AF-101M:VLS6045AF-101M
LED1-LED4 = 113-314-04:113-314-04
LED_+3.3V_VDD LED_+3V3_VDDA LED_DEBUG1-LED_DEBUG4 = led:LED: LED OSRAM: - CHIPLED LG R971, LG N971, LY N971, LG Q971, LY Q971, LO R971, LY R971 LH N974, LH R974 LS Q976, LO Q976, LY Q976 LO Q996 - Hyper CHIPLED LW Q18S LB Q993, LB Q99A, LB R99A - SideLED LS A670, LO A670, LY A670, LG A670, LP A670 LB A673, LV A673, LT A673, LW A673 LH A674 LY A675 LS A676, LA A676, LO A676, LY A676, LW A676 LS A679, LY A679, LG A679 - Hyper Micro SIDELED® LS Y876, LA Y876, LO Y876, LY Y876 LT Y87S - SmartLED LW L88C, LW L88S LB L89C, LB L89S, LG L890 LS L89K, LO L89K, LY L89K LS L896, LA L896, LO L896, LY L896 - TOPLED LS T670, LO T670, LY T670, LG T670, LP T670 LSG T670, LSP T670, LSY T670, LOP T670, LYG T670 LG T671, LOG T671, LSG T671 LB T673, LV T673, LT T673, LW T673 LH T674 LS T676, LA T676, LO T676, LY T676, LB T676, LH T676, LSB T676, LW T676 LB T67C, LV T67C, LT T67C, LS T67K, LO T67K, LY T67K, LW E67C LS E67B, LA E67B, LO E67B, LY E67B, LB E67C, LV E67C, LT E67C LW T67C LS T679, LY T679, LG T679 LS T770, LO T770, LY T770, LG T770, LP T770 LB T773, LV T773, LT T773, LW T773 LH T774 LS E675, LA E675, LY E675, LS T675 LS T776, LA T776, LO T776, LY T776, LB T776 LHGB T686 LT T68C, LB T68C - Hyper Mini TOPLED® LB M676 - Mini TOPLED Santana® LG M470 LS M47K, LO M47K, LY M47K Source: http://www.osram.convergy.de LUXEON: - LUMILED® LXK2-PW12-R00, LXK2-PW12-S00, LXK2-PW14-U00, LXK2-PW14-V00 LXK2-PM12-R00, LXK2-PM12-S00, LXK2-PM14-U00 LXK2-PE12-Q00, LXK2-PE12-R00, LXK2-PE12-S00, LXK2-PE14-T00, LXK2-PE14-U00 LXK2-PB12-K00, LXK2-PB12-L00, LXK2-PB12-M00, LXK2-PB14-N00, LXK2-PB14-P00, LXK2-PB14-Q00 LXK2-PR12-L00, LXK2-PR12-M00, LXK2-PR14-Q00, LXK2-PR14-R00 LXK2-PD12-Q00, LXK2-PD12-R00, LXK2-PD12-S00 LXK2-PH12-R00, LXK2-PH12-S00 LXK2-PL12-P00, LXK2-PL12-Q00, LXK2-PL12-R00 Source: www.luxeon.com KINGBRIGHT: KA-3528ASYC Source: www.kingbright.com
MCU = STM32H753ZIT6:STM32H753ZIT6
PCB_BRACKET = 60807-011:60807-011
R1-R10 R15-R19 R60-R67 = RCL:R-EU_: RESISTOR, European symbol; SPICEPREFIX: R
SJ1 = JUMPER:SJ2W: SMD solder JUMPER
SW_RST_MCU = TP33W008000:TP33W008000
TP_DEBUG1-TP_DEBUG4 TP_GND1-TP_GND4 = RSPRO-1MM-TERMINAL-POST-2622034:RSPRO-1MM-TERMINAL-POST-2622034
XTAL1 = XRCGB25M000F2P00R0:XRCGB25M000F2P00R0
XTAL2 = ABS05-32.768KHZ-T:ABS05-32.768KHZ-T
XTAL3 = FOXSDLF-240F-20:FOXSDLF-240F-20

## Board
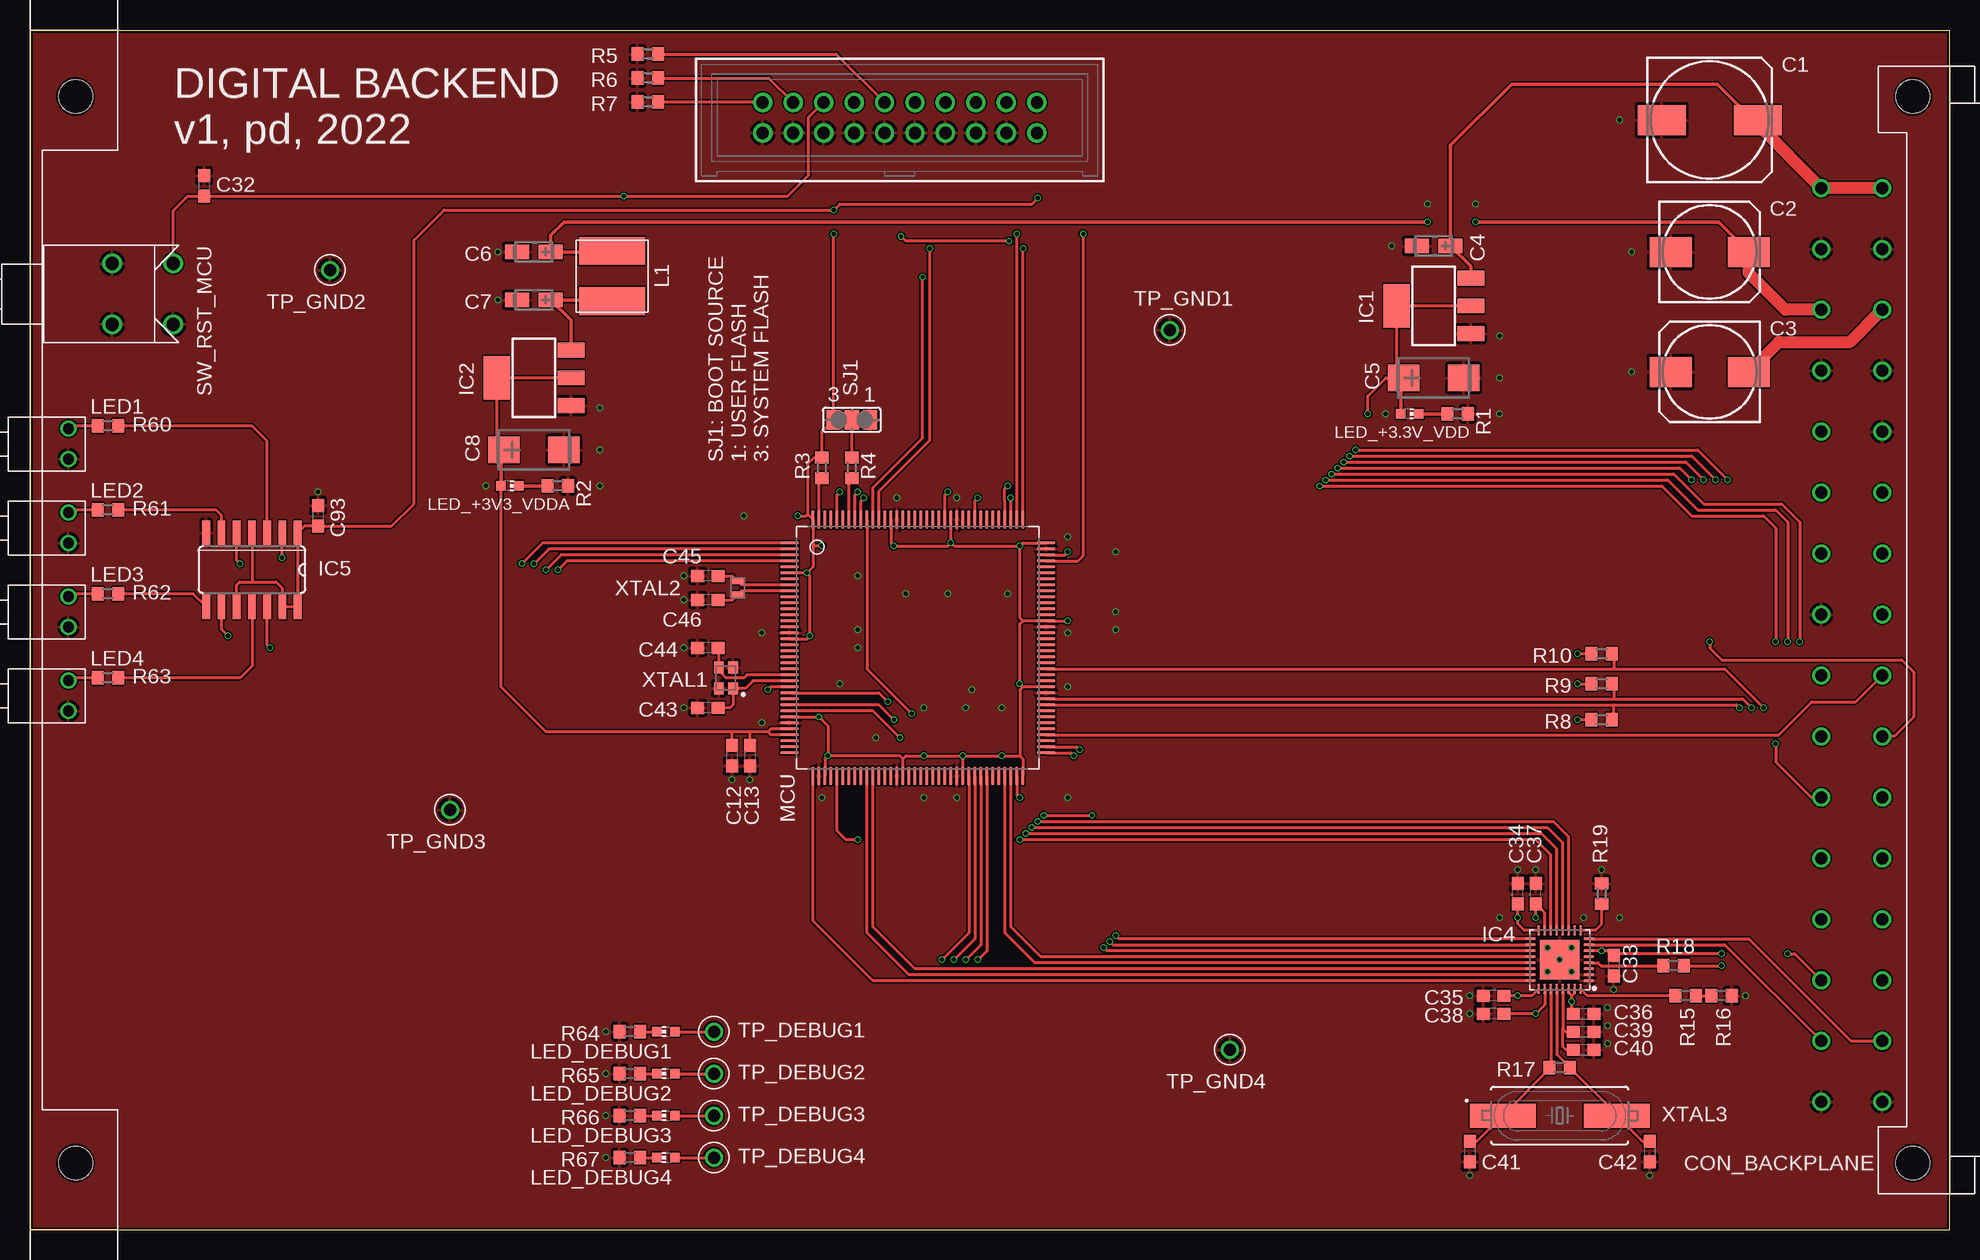
[diagram p6: board, top side]
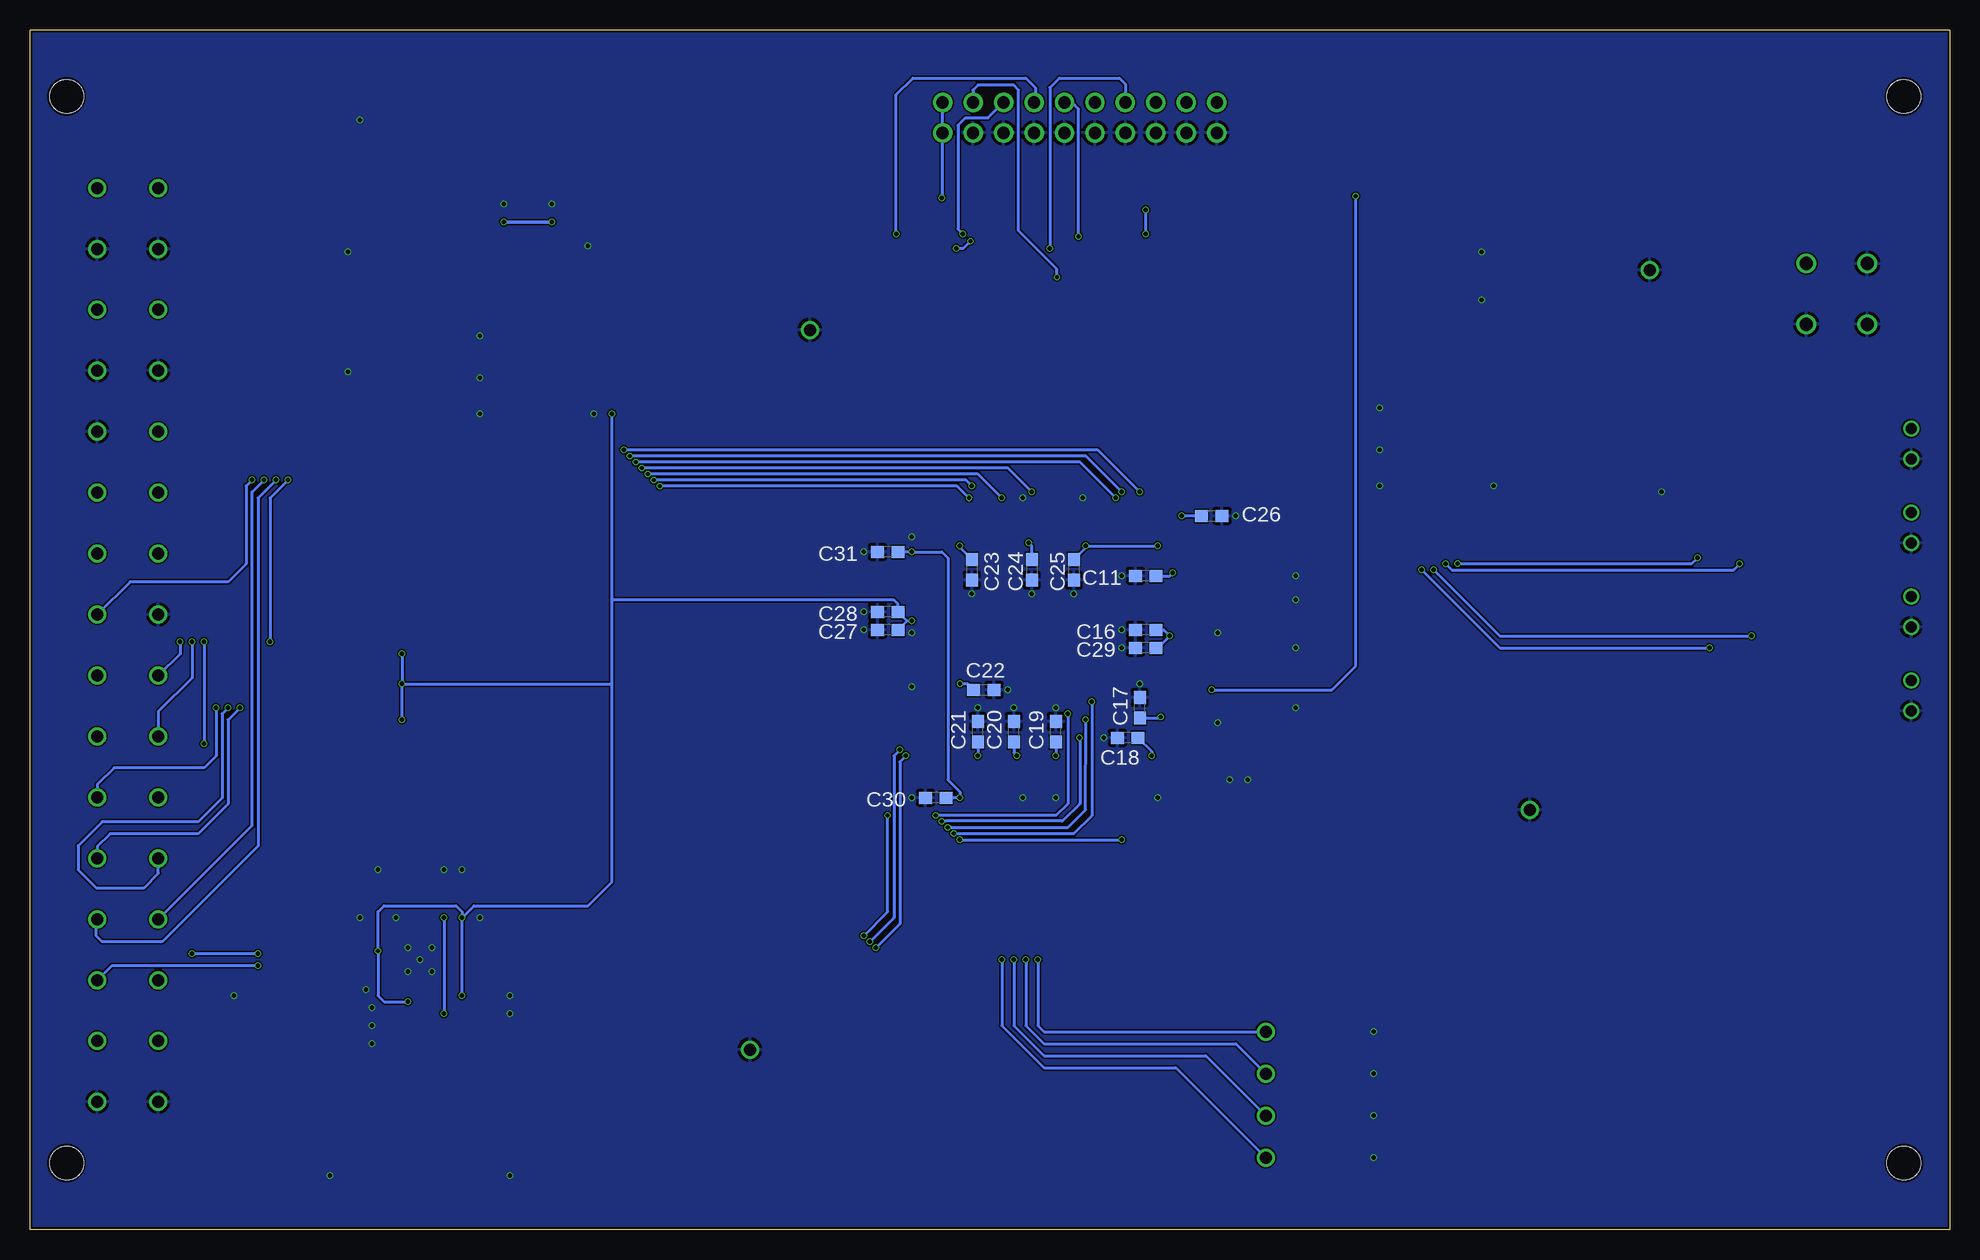
[diagram p7: board, bottom side, seen from below]

Size 160 x 100 mm. Coordinates in mm from the lower left corner, seen from the top.
Outline: 0,0 160,0 160,100 0,100 0,0
Copper layers (1*16): Top 0.035559375mm / dielectric 1.6mm / Bottom 0.035559375mm
Design rules "jlcpcb2layer": minimum track width 5mil, minimum drill 12mil, track to track 5mil, track to pad 5mil, pad to pad 5mil, via to via 5mil, smd to smd 5mil, copper to edge 8mil, drill to drill 6mil, minimum pad ring 5mil, minimum via ring 3mil, stop-mask expansion 2.5mil, vias tented up to drill 0mil, thermal gap 10mil

### Footprints (pad centres in the part's own frame; a part is rotated, then mirrored left to right if it is on the bottom)
153CLV-1010 = smd 4 x 2.5: + 4,0; - -4,0
153CLV-0810 = smd 3.5 x 2.5: + 3.25,0; - -3.25,0
CT3216 = smd 2 x 1.2: + -1.4,0; - 1.4,0
CT6032 = smd 2.6 x 2.2: + -2.5,0; - 2.5,0
C0603 = smd 1.1 x 1: 1 -0.85,0; 2 0.85,0
09031326921 = drill 1: 1 36.83,10.7; 2 36.83,5.62; 3 31.75,10.7; 4 31.75,5.62; 5 26.67,10.7; 6 26.67,5.62; 7 21.59,10.7; 8 21.59,5.62; 9 16.51,10.7; 10 16.51,5.62; 11 11.43,10.7; 12 11.43,5.62; 13 6.35,10.7; 14 6.35,5.62; 15 1.27,10.7; 16 1.27,5.62; 17 -3.81,10.7; 18 -3.81,5.62; 19 -8.89,10.7; 20 -8.89,5.62; 21 -13.97,10.7; 22 -13.97,5.62; 23 -19.05,10.7; 24 -19.05,5.62; 25 -24.13,10.7; 26 -24.13,5.62; 27 -29.21,10.7; 28 -29.21,5.62; 29 -34.29,10.7; 30 -34.29,5.62; 31 -39.37,10.7; 32 -39.37,5.62 | hole 2.8: -44.45,3.05; 44.45,3.05
TST-110-01-T-D = drill 1.02 pad 1.62: 1 -11.43,-1.46; 2 -11.43,1.08; 3 -8.89,-1.46; 4 -8.89,1.08; 5 -6.35,-1.46; 6 -6.35,1.08; 7 -3.81,-1.46; 8 -3.81,1.08; 9 -1.27,-1.46; 10 -1.27,1.08; 11 1.27,-1.46; 12 1.27,1.08; 13 3.81,-1.46; 14 3.81,1.08; 15 6.35,-1.46; 16 6.35,1.08; 17 8.89,-1.46; 18 8.89,1.08; 19 11.43,-1.46; 20 11.43,1.08
SOT223 = smd 2.235 x 1.219: 1 -3.099,2.311; 2 -3.099,0; 3 -3.099,-2.311 | smd 2.2 x 3.6: TAB 3.099,0
USB3300-EZK = smd 0.86 x 0.26: 1 -2.435,1.75; 2 -2.435,1.25; 3 -2.435,0.75; 4 -2.435,0.25; 5 -2.435,-0.25; 6 -2.435,-0.75; 7 -2.435,-1.25; 8 -2.435,-1.75; 17 2.435,-1.75; 18 2.435,-1.25; 19 2.435,-0.75; 20 2.435,-0.25; 21 2.435,0.25; 22 2.435,0.75; 23 2.435,1.25; 24 2.435,1.75 | smd 0.26 x 0.86: 9 -1.75,-2.435; 10 -1.25,-2.435; 11 -0.75,-2.435; 12 -0.25,-2.435; 13 0.25,-2.435; 14 0.75,-2.435; 15 1.25,-2.435; 16 1.75,-2.435; 25 1.75,2.435; 26 1.25,2.435; 27 0.75,2.435; 28 0.25,2.435; 29 -0.25,2.435; 30 -0.75,2.435; 31 -1.25,2.435; 32 -1.75,2.435 | smd 3.3 x 3.3: 33 0,0
SO14 = smd 0.66 x 2.032: 1 -3.81,-3.073; 2 -2.54,-3.073; 3 -1.27,-3.073; 4 0,-3.073; 5 1.27,-3.073; 6 2.54,-3.073; 7 3.81,-3.073; 8 3.81,3.073; 9 2.54,3.073; 10 1.27,3.073; 11 0,3.073; 12 -1.27,3.073; 13 -2.54,3.073; 14 -3.81,3.073
VLS6045AF-101M = smd 2.3 x 5.5: 1 -2.1,0; 2 2.1,0
113-314-04 = drill 0.9: + -1.27,0; - 1.27,0
CHIP-LED0603 = smd 0.8 x 0.8: A 0,-0.75; C 0,0.75
LQFP144 = smd 1.56 x 0.28: 1 -10.68,8.75; 2 -10.68,8.25; 3 -10.68,7.75; 4 -10.68,7.25; 5 -10.68,6.75; 6 -10.68,6.25; 7 -10.68,5.75; 8 -10.68,5.25; 9 -10.68,4.75; 10 -10.68,4.25; 11 -10.68,3.75; 12 -10.68,3.25; 13 -10.68,2.75; 14 -10.68,2.25; 15 -10.68,1.75; 16 -10.68,1.25; 17 -10.68,0.75; 18 -10.68,0.25; 19 -10.68,-0.25; 20 -10.68,-0.75; 21 -10.68,-1.25; 22 -10.68,-1.75; 23 -10.68,-2.25; 24 -10.68,-2.75; 25 -10.68,-3.25; 26 -10.68,-3.75; 27 -10.68,-4.25; 28 -10.68,-4.75; 29 -10.68,-5.25; 30 -10.68,-5.75; 31 -10.68,-6.25; 32 -10.68,-6.75; 33 -10.68,-7.25; 34 -10.68,-7.75; 35 -10.68,-8.25; 36 -10.68,-8.75; 73 10.68,-8.75; 74 10.68,-8.25; 75 10.68,-7.75; 76 10.68,-7.25; 77 10.68,-6.75; 78 10.68,-6.25; 79 10.68,-5.75; 80 10.68,-5.25; 81 10.68,-4.75; 82 10.68,-4.25; 83 10.68,-3.75; 84 10.68,-3.25; 85 10.68,-2.75; 86 10.68,-2.25; 87 10.68,-1.75; 88 10.68,-1.25; 89 10.68,-0.75; 90 10.68,-0.25; 91 10.68,0.25; 92 10.68,0.75; 93 10.68,1.25; 94 10.68,1.75; 95 10.68,2.25; 96 10.68,2.75; 97 10.68,3.25; 98 10.68,3.75; 99 10.68,4.25; 100 10.68,4.75; 101 10.68,5.25; 102 10.68,5.75; 103 10.68,6.25; 104 10.68,6.75; 105 10.68,7.25; 106 10.68,7.75; 107 10.68,8.25; 108 10.68,8.75 | smd 0.28 x 1.56: 37 -8.75,-10.68; 38 -8.25,-10.68; 39 -7.75,-10.68; 40 -7.25,-10.68; 41 -6.75,-10.68; 42 -6.25,-10.68; 43 -5.75,-10.68; 44 -5.25,-10.68; 45 -4.75,-10.68; 46 -4.25,-10.68; 47 -3.75,-10.68; 48 -3.25,-10.68; 49 -2.75,-10.68; 50 -2.25,-10.68; 51 -1.75,-10.68; 52 -1.25,-10.68; 53 -0.75,-10.68; 54 -0.25,-10.68; 55 0.25,-10.68; 56 0.75,-10.68; 57 1.25,-10.68; 58 1.75,-10.68; 59 2.25,-10.68; 60 2.75,-10.68; 61 3.25,-10.68; 62 3.75,-10.68; 63 4.25,-10.68; 64 4.75,-10.68; 65 5.25,-10.68; 66 5.75,-10.68; 67 6.25,-10.68; 68 6.75,-10.68; 69 7.25,-10.68; 70 7.75,-10.68; 71 8.25,-10.68; 72 8.75,-10.68; 109 8.75,10.68; 110 8.25,10.68; 111 7.75,10.68; 112 7.25,10.68; 113 6.75,10.68; 114 6.25,10.68; 115 5.75,10.68; 116 5.25,10.68; 117 4.75,10.68; 118 4.25,10.68; 119 3.75,10.68; 120 3.25,10.68; 121 2.75,10.68; 122 2.25,10.68; 123 1.75,10.68; 124 1.25,10.68; 125 0.75,10.68; 126 0.25,10.68; 127 -0.25,10.68; 128 -0.75,10.68; 129 -1.25,10.68; 130 -1.75,10.68; 131 -2.25,10.68; 132 -2.75,10.68; 133 -3.25,10.68; 134 -3.75,10.68; 135 -4.25,10.68; 136 -4.75,10.68; 137 -5.25,10.68; 138 -5.75,10.68; 139 -6.25,10.68; 140 -6.75,10.68; 141 -7.25,10.68; 142 -7.75,10.68; 143 -8.25,10.68; 144 -8.75,10.68
60807-011 = hole 2.8: 0,44.45; 0,-44.45
R0603 = smd 1 x 1.1: 1 -0.85,0; 2 0.85,0
SJ_2 = smd 1.168 x 1.6: 1 -1.524,0; 2 0,0; 3 1.524,0
TP33W008000 = drill 1.1: GND1 -2.54,-2.54; GND2 -2.54,2.54; P1 2.54,-2.54; P3 2.54,2.54
RSPRO-1MM-TERMINAL-POST-2622034 = drill 1: P$1 0,0
XRCGB25M000F2P00R0 = smd 0.8 x 1: 1 -0.6,0.875; 2 -0.6,-0.875; 3 0.6,-0.875; 4 0.6,0.875
ABS05-32.768KHZ-T = smd 0.5 x 1: 1 -0.55,0; 2 0.55,0
FOXSDLF-240F-20 = smd 5.5 x 2: 1 -4.75,0; 2 4.75,0

### Placement (x,y rotation side)
C1  140,92.5 0 top
C2  140,81.5 0 top
C3  140,71.5 180 top
C4  117,82 180 top
C5  117,71 0 top
C6  42,81.5 180 top
C7  42,77.5 180 top
C8  42,65 0 top
C11  67,54.5 180 bottom
C12  58.5,39.5 270 top
C13  60,39.5 270 top
C16  67,50 180 bottom
C17  67.5,43.5 90 bottom
C18  68.5,41 180 bottom
C19  74.5,41.5 90 bottom
C20  78,41.5 90 bottom
C21  81,41.5 90 bottom
C22  80.5,45 0 bottom
C23  81.5,55 270 bottom
C24  76.5,55 270 bottom
C25  73,55 270 bottom
C26  61.5,59.5 0 bottom
C27  88.5,50 180 bottom
C28  88.5,51.5 180 bottom
C29  67,48.5 180 bottom
C30  84.5,36 180 bottom
C31  88.5,56.5 180 bottom
C32  14.5,87 270 top
C33  132,22 270 top
C34  124,28 90 top
C35  122,19.5 180 top
C36  129.5,18 0 top
C37  125.5,28 90 top
C38  122,18 180 top
C39  129.5,16.5 0 top
C40  129.5,15 0 top
C41  120,6.5 270 top
C42  135,6.5 270 top
C43  56.5,43.5 180 top
C44  56.5,48.5 180 top
C45  56.5,54.5 180 top
C46  56.5,52.5 180 top
C93  24,59.5 270 top
CON_BACKPLANE  160,50 90 top
CON_JTAG  72.5,92.5 180 top
IC1  117,77 180 top
IC2  42,71 180 top
IC4  127.5,22.5 180 top
IC5  18.5,55 180 top
L1  48.5,79.5 270 top
LED1  3.2,65.5 270 top
LED2  3.2,58.5 270 top
LED3  3.2,51.5 270 top
LED4  3.2,44.5 270 top
LED_+3.3V_VDD  115,68 270 top
LED_+3V3_VDDA  40,62 270 top
LED_DEBUG1  53,16.5 90 top
LED_DEBUG2  53,13 90 top
LED_DEBUG3  53,9.5 90 top
LED_DEBUG4  53,6 90 top
MCU  74,48.5 0 top
PCB_BRACKET  3.8,50 0 top
R1  119,68 0 top
R2  44,62 0 top
R3  66,63.5 90 top
R4  68.5,63.5 270 top
R5  51.5,98 0 top
R6  51.5,96 0 top
R7  51.5,94 0 top
R8  131,42.5 180 top
R9  131,45.5 180 top
R10  131,48 180 top
R15  138,19.5 180 top
R16  141,19.5 180 top
R17  127.5,13.5 180 top
R18  137,22 0 top
R19  131,28 270 top
R60  6.5,67 180 top
R61  6.5,60 180 top
R62  6.5,53 180 top
R63  6.5,46 180 top
R64  50,16.5 180 top
R65  50,13 180 top
R66  50,9.5 180 top
R67  50,6 180 top
SJ1  68.5,67.5 180 top
SW_RST_MCU  9.39,78 0 top
TP_DEBUG1  57,16.5 270 top
TP_DEBUG2  57,13 270 top
TP_DEBUG3  57,9.5 270 top
TP_DEBUG4  57,6 270 top
TP_GND1  95,75 0 top
TP_GND2  25,80 180 top
TP_GND3  35,35 180 top
TP_GND4  100,15 180 top
XTAL1  58,46 180 top
XTAL2  59,53.5 270 top
XTAL3  127.5,9.5 0 top

### Tracks (layer width: path | path; a pad name or v marks a point on that pad's centre or on a via)
+3V3_VDD  (via drill 0.35)
  Top 0.254: C36.1 128.5,18.15 v128.5,19 128.5,19.5 | 128.5,19.5 128.75,19.75 IC4.31 | 128.5,19.5 128.25,19.75 IC4.30 | IC4.25 125.19,19.5 v124,19.5 C35.1 | IC4.16 124.56,24.93 124,25.5 v124,26 C34.1 | 65.25,57 MCU.144 64.8,59.63 | 65.25,57 65.25,55.25 v64.75,54.75 | v64.75,54.75 MCU.6 | MCU.131 71.75,57.25 v72,57 76.5,57 v76.75,57.25 | v76.75,57.25 MCU.121 | v66,57 65.25,57 | 82.75,50.75 MCU.95 v86.5,50.75 | 82.75,50.75 82.5,51 v82.5,57 | v82.5,57 82.75,57.25 MCU.108 | MCU.84 82.75,45.25 | 82.75,45.25 82.5,45.5 | 82.5,45.5 82.5,50.5 82.75,50.75 | MCU.62 v77.75,39.5 | v77.75,39.5 v81,39.5 82.5,39.5 | 82.5,39.5 82.75,39.25 MCU.72 | 82.75,45.25 82.5,45 82.5,39.5 | MCU.52 72.75,39.25 | 72.75,39.25 73,39.5 v74.5,39.5 v77.75,39.5 | 72.75,39.25 72.5,39.5 v66.5,39.5 | v66.5,39.5 66.25,39.25 MCU.39 | MCU.30 65.75,42.75 | v66.5,39.5 66.5,42 65.75,42.75 | MCU.17 64.75,49.25 v65,49.5 65,54.5 v64.75,54.75 | v76.75,57.25 77,57 v82.5,57 | v67,83 66.98,82.98 SJ1.3 66,66.52 R3.2 65.35,64.35 64.8,63.8 64.8,59.63 | v84,86 83.5,85.5 67.5,85.5 v67,85 34.5,85 32,82.5 32,60.5 30.15,58.65 C93.2 22.89,58.65 IC5.1 IC5.14 IC5.13 21.04,53.46 20.5,54 18.5,54 | v111.5,68 111.5,69.5 113,71 114,71 C5.+ | v65.75,42.73 65.75,42.75 | v82.48,45.5 82.5,45.5 | R8.2 v129,42.5 | v129,45.5 R9.2 | R10.2 v129,48 | v146.5,23 147.09,23 CON_BACKPLANE.27 | v141,23 132.15,23 C33.1 131.6,23.25 131,23.25 | 131,23.25 IC4.6 | 131,23.25 v131,23.23 | IC1.2 IC1.TAB 113.9,71.1 | IC5.10 17.23,53.73 17.5,54 18.5,54 | IC5.4 18.5,54 | v64,59.5 64.67,59.5 64.8,59.63
  Top 0.305: LED_+3.3V_VDD.A 114.25,70.75 | 114.25,70.75 C5.+ | 113.9,71.1 114,71 114.25,70.75
  Bottom 0.254: v128.5,19 130.5,19 131,19.5 v131,23.23 131,26.5 130.5,27 124.5,27 124,26.5 v124,26 | v66,57 v72,57 72,56.85 C25.1 | C11.1 65,54.5 v64.75,54.75 | 86.9,50.75 C28.1 87.65,52.15 88,52.5 111.5,52.5 | v86.5,50.75 86.9,50.75 | 86.9,50.75 C27.1 | v67,83 v67,85 | v84,86 83.93,86.07 CON_JTAG.2 CON_JTAG.1 | v124,26 123,27 113.5,27 111.5,29 111.5,45.5 | 111.5,45.5 111.5,52.5 | 111.5,52.5 v111.5,68 | C29.1 66,48.5 v65,49.5 65.5,50 C16.1 | C17.1 65.83,42.65 v65.75,42.73 | C18.1 66.5,39.85 v66.5,39.5 | C19.1 v74.5,39.5 | C20.1 78,39.75 v77.75,39.5 | C21.1 v81,39.5 | C24.1 76.5,57 v76.75,57.25 | C23.1 82.5,56.85 v82.5,57 | C22.1 81.85,45.5 v82.48,45.5 | v129,42.5 v129,45.5 | v129,48 v129,45.5 | v129,45.5 111.5,45.5 | v141,23 v146.5,23 | v124,19.5 v124,26 | C26.1 v64,59.5
+3V3_VDDA
  Top 0.254: MCU.33 61.75,41.25 61.5,41.5 | MCU.32 61.75,41.75 61.5,41.5 | 61.5,41.5 60,41.5 | 60,41.5 58.5,41.5 | 58.5,41.5 43,41.5 39.25,45.25 LED_+3V3_VDDA.A | C12.1 58.5,41.5 | C13.1 60,41.5 | IC2.2 IC2.TAB 38.9,65.6 C8.+
  Top 0.305: LED_+3V3_VDDA.A 39.25,64.5 39.25,64.75 C8.+
+5V
  Top 0.305: IC1.3 120.1,80.3 C4.+ 118.4,90.4 123.5,95.5 140.63,95.5 144,92.13
  Top 1.016: CON_BACKPLANE.2 CON_BACKPLANE.1 | CON_BACKPLANE.1 149.17,86.83 149,87 149.13,87 CON_BACKPLANE.1 | CON_BACKPLANE.1 144,92.13 C1.+
+12V  (via drill 0.35)
  Top 0.305: v120.5,84 140.75,84 C2.+ | v116.5,84 44.5,84 43.4,82.9 C6.+ 48.4,81.5 L1.1
  Top 1.016: CON_BACKPLANE.5 146.33,76.67 143.25,79.75 C2.+
  Bottom 0.305: v116.5,84 v120.5,84
-12V
  Top 1.016: C3.- 145.75,74 151.71,74 CON_BACKPLANE.6
DEBUG1  (via drill 0.35)
  Top 0.254: LED_DEBUG1.A TP_DEBUG1.P$1 | v76,22.5 78.25,24.75 MCU.63
  Bottom 0.254: TP_DEBUG1.P$1 75.5,16.5 76,17 v76,22.5
DEBUG2  (via drill 0.35)
  Top 0.254: LED_DEBUG2.A TP_DEBUG2.P$1 | v77,22.5 78.75,24.25 MCU.64
  Bottom 0.254: TP_DEBUG2.P$1 59.5,15.5 75.5,15.5 77,17 v77,22.5
DEBUG3  (via drill 0.35)
  Top 0.254: LED_DEBUG3.A TP_DEBUG3.P$1 | MCU.65 79.25,23.75 v78,22.5
  Bottom 0.254: TP_DEBUG3.P$1 62,14.5 75.5,14.5 78,17 v78,22.5
DEBUG4  (via drill 0.35)
  Top 0.254: LED_DEBUG4.A TP_DEBUG4.P$1 | MCU.66 79.75,23.25 v79,22.5
  Bottom 0.254: TP_DEBUG4.P$1 64.5,13.5 75.5,13.5 79,17 v79,22.5
GND  (via drill 0.35)
  other vias: 47.5,62 47.5,68.5 47.5,65 39,81.5 133.5,71.5 133.5,81.5 132.5,92.5 122.5,71 122.5,68 122.5,74.5 113.5,82 120.5,85.5 116.5,85.5 113,68 38,62 39,77.5 131.5,17 131.5,15.5 120,18 120,4.5 135,4.5 132,20 131,30 125.5,30 124,30 131.5,18.5 143,19.5 120,19.5 129.5,26 132.5,26 122.5,26 54.5,43.5 54.5,48.5 54.5,52.5 54.5,54.5 58.5,37.5 60,37.5 90.5,56.5 90.5,51.5 90.5,50 69,54.5 69,50 69,48.5 67.5,45.5 70.5,41 74.5,43.5 78,43.5 81,43.5 78.5,45 81.5,53 76.5,53 73,53 59.5,59.5 86.5,36 48,16.5 48,13 48,9.5 48,6 72.25,61 77.25,61 86.5,57.75 86.5,49.75 86.5,45.25 77.25,36 66,36 74.5,36 61,42.25 61,49.75 24,61.5 126.5,23.5 128.5,23.5 127.5,22.5 126.5,21.5 128.5,21.5
  pour Top: 0,0 160,0 160,100 0,100
  pour Bottom: 0,0 160,0 160,100 0,100
I2C4_NINT  (via drill 0.35)
  Top 0.254: MCU.87 132,46.75 | 132,46.75 141.25,46.75 v144.5,43.5 | R10.1 132,47.85 132,46.75
  Bottom 0.254: v144.5,43.5 144.5,39.5 145.5,38.5 153,38.5 154.38,37.12 CON_BACKPLANE.22
I2C4_SCL  (via drill 0.35)
  Top 0.254: MCU.81 132,43.75 | 132,43.75 142.25,43.75 v142.5,43.5 | R8.1 132,42.65 132,43.75
  Bottom 0.254: v142.5,43.5 143.5,42.5 143.5,35.5 146,33 153.33,33 154.38,31.95 CON_BACKPLANE.24
I2C4_SDA  (via drill 0.35)
  Top 0.254: v143.5,43.5 142.75,44.25 132,44.25 | MCU.82 132,44.25 | R9.1 132,45.35 132,44.25
  Bottom 0.254: v143.5,43.5 144,43 144,36 146,34 154,34 156,32 156,30 154.5,28.5 150.5,28.5 149.3,29.7 CON_BACKPLANE.23
JTCK/SWCLK  (via drill 0.35)
  Top 0.254: MCU.109 82.75,81.75 v82.8,81.8 | v81.6,82.4 73,82.4 v72.6,82.8
  Bottom 0.254: v82.8,81.8 82.2,81.8 v81.6,82.4 | v72.6,82.8 72.6,93.4 73.16,93.96 CON_JTAG.9
JTDI  (via drill 0.35)
  Top 0.254: MCU.110 v82.25,83
  Bottom 0.254: CON_JTAG.5 80.13,92.68 82.03,92.68 82.65,92.06 82.65,83.4 v82.25,83
JTDO/TRACESWO  (via drill 0.35)
  Top 0.254: MCU.133 70.75,61.55 75,65.8 v75,81.8
  Bottom 0.254: v75,81.8 75,95.2 74.2,96 69.2,96 68.69,95.49 CON_JTAG.13
JTMS/SWDIO  (via drill 0.35)
  Top 0.254: MCU.105 87.35,55.75 87.8,56.2 v87.8,83
  Bottom 0.254: v87.8,83 87.8,94.6 86.4,96 77,96 76.2,95.2 76.2,94.07 CON_JTAG.7
LED1  (via drill 0.35)
  Top 0.254: MCU.1 42.73,57.25 v41,55.52 | v21,56 21,58.03 IC5.2
  Bottom 0.254: v41,55.52 21.48,55.52 v21,56
LED2  (via drill 0.35)
  Top 0.254: v17.5,55.5 17.23,55.77 IC5.5 | v42,55.5 43.25,56.75 MCU.2
  Bottom 0.254: v17.5,55.5 18,55 41.5,55 v42,55.5
LED3  (via drill 0.35)
  Top 0.254: MCU.3 44.25,56.25 v43,55 | v16.5,49.5 15.96,50.04 IC5.9
  Bottom 0.254: v16.5,49.5 37.5,49.5 v43,55
LED4  (via drill 0.35)
  Top 0.254: MCU.4 44.75,55.75 v44,55 | v20,48.5 19.77,48.73 IC5.12
  Bottom 0.254: v20,48.5 37.5,48.5 v44,55
N$1  (via drill 0.35)
  Top 0.254: IC4.26 126.25,18.75 v125.5,18 C38.1 | IC4.15 126.25,26.4 C37.1 v125.5,26
  Bottom 0.254: v125.5,26 v125.5,18
N$2
  Top 0.254: MCU.143 65.75,62.4 R3.1
N$3
  Top 0.254: MCU.138 68.25,62.4 R4.2
N$4
  Top 0.305: IC2.3 45.1,75.8 C7.+ 48.4,77.5 L1.2
N$5
  Top 0.254: R4.1 SJ1.2
N$6
  Top 0.254: CON_JTAG.19 52.39,93.96 R7.2
N$7
  Top 0.254: R6.2 61.57,96 CON_JTAG.17
N$8
  Top 0.254: R5.2 67.19,98 CON_JTAG.11
N$9
  Top 0.254: C45.1 58.55,54.5 XTAL2.1 59.3,53.75 MCU.8
N$10
  Top 0.254: MCU.23 59.75,46.25 59.5,46 58,46 57.4,46.6 XTAL1.3 57.4,48.45 C44.1
N$11
  Top 0.254: MCU.24 60.25,45.75 59.62,45.12 XTAL1.1 58.6,43.75 58.35,43.5 C43.1
N$12
  Top 0.254: IC4.29 127.75,16.75 | 127.75,16.75 128,16.5 C39.1 | C40.1 128,15 127.75,15.25 127.75,16.75
N$13
  Top 0.254: R60.2 3.43,67 LED1.+
N$14
  Top 0.254: R61.2 3.43,60 LED2.+
N$15
  Top 0.254: R62.2 3.43,53 LED3.+
N$16
  Top 0.254: R63.2 3.43,46 LED4.+
N$18
  Top 0.254: R15.1 R16.2
N$22
  Top 0.254: IC4.32 129.83,19.48 137.13,19.48 R15.2
N$23
  Top 0.254: IC4.27 126.75,13.6 R17.2 126.65,13.4 XTAL3.1 120.6,7.35 C41.1
N$24
  Top 0.254: IC4.28 127.25,14.6 R17.1 132.25,9.6 XTAL3.2 134.4,7.35 C42.1
N$25
  Top 0.254: IC4.4 130.69,22.25 130.94,22 R18.1
N$26
  Top 0.254: IC4.9 129.31,25 130.5,25 131,25.5 R19.2
N$28
  Top 0.254: C46.1 58.55,52.5 XTAL2.2 59.3,53.25 MCU.9
N$49
  Top 0.305: LED_+3.3V_VDD.C R1.1
N$50
  Top 0.305: R2.1 LED_+3V3_VDDA.C
N$65
  Top 0.254: IC5.3 19.77,65.73 18.5,67 R60.1
N$66
  Top 0.254: IC5.6 15.96,59.54 15.5,60 R61.1
N$67
  Top 0.254: IC5.8 13.62,53 R62.1
N$68
  Top 0.254: IC5.11 18.5,47 17.5,46 R63.1
N$76
  Top 0.254: R64.1 LED_DEBUG1.C
N$83
  Top 0.254: R65.1 LED_DEBUG2.C
N$84
  Top 0.254: R66.1 LED_DEBUG3.C
N$85
  Top 0.254: R67.1 LED_DEBUG4.C
NJTRST  (via drill 0.35)
  Top 0.254: MCU.134 70.25,61.85 74.4,66 v74.4,79.4
  Bottom 0.254: CON_JTAG.3 81.4,95 81,95.4 78,95.4 77.6,95 77.6,83.27 74.4,80.07 v74.4,79.4
NRST  (via drill 0.35)
  Top 0.254: CON_JTAG.15 64.9,92.71 64.9,87.9 63.15,86.15 v49.5,86.15 C32.2 13.15,86.15 11.93,84.93 SW_RST_MCU.P3 | MCU.25 61.75,45.25 v61.5,45
  Bottom 0.254: v49.5,86.15 49.5,47 51.5,45 v61.5,45
SPI2_MOSI
  Top 0.254: MCU.76 145.75,41.25 148.5,44 152.19,44 CON_BACKPLANE.18
SPI2_NSS  (via drill 0.35)
  Top 0.254: MCU.140 67.25,61.25 v67.5,61.5 | v141.5,62.5 139,65 v110.5,65
  Bottom 0.254: v67.5,61.5 71,65 v110.5,65 | v141.5,62.5 142,62 142,55.5 143.5,54 151.65,54 CON_BACKPLANE.16
SPI2_SCK  (via drill 0.35)
  Top 0.254: MCU.117 78.75,60.75 v79,61 | v108.5,62.98 108.77,62.98 108.79,62.97 109.21,62.97 109.25,63 137,63 139.5,60.5 146,60.5 147.5,59 v147.5,49
  Bottom 0.254: v79,61 81,63 108.48,63 v108.5,62.98 | v147.5,49 147.5,47.99 CON_BACKPLANE.17
SPI3_MISO  (via drill 0.35)
  Top 0.254: MCU.112 81.25,60.75 81.22,60.79 81.22,61.72 v81.5,62 | v108,62.48 108.27,62.48 108.29,62.47 108.71,62.47 108.75,62.5 136.5,62.5 139,60 145.5,60 146.5,59 v146.5,49
  Bottom 0.254: v81.5,62 82,62.5 107.98,62.5 v108,62.48 | v146.5,49 146.5,46 149.3,43.2 CON_BACKPLANE.19
SPI3_MOSI  (via drill 0.35)
  Top 0.254: MCU.122 76.25,61.25 v76.5,61.5 | v109,63.48 109.27,63.48 109.29,63.47 109.71,63.47 109.75,63.5 137.5,63.5 v138.5,62.5 | v140,49 140,48.5 141,47.5 156,47.5 157,46.5 157,42.73 155.38,41.11 CON_BACKPLANE.20
  Bottom 0.254: v76.5,61.5 78.5,63.5 108.98,63.5 v109,63.48 | v138.5,62.5 140,61 v140,49
SPI3_SCK  (via drill 0.35)
  Top 0.254: MCU.111 81.75,60.98 v81.73,61 | v107.5,61.98 107.77,61.98 107.79,61.97 108.21,61.97 108.25,62 136,62 138.5,59.5 144.5,59.5 145.5,58.5 v145.5,49 | v145.5,40.5 145.5,39 148.47,36.03 CON_BACKPLANE.21
  Bottom 0.254: v81.73,61 82.73,62 107.48,62 v107.5,61.98 | v145.5,49 v145.5,40.5
ULPI_CLK  (via drill 0.35)
  Top 0.254: IC4.14 126.75,31.25 125.5,32.5 v82.5,32.5 | v69,32.5 68,32.5 67.25,33.25 MCU.41
  Bottom 0.254: v82.5,32.5 v69,32.5
ULPI_DATA0
  Top 0.254: MCU.37 65.25,25.75 70.25,20.75 IC4.24
ULPI_DATA1
  Top 0.254: IC4.23 73.25,21.25 69.75,24.75 MCU.46
ULPI_DATA2
  Top 0.254: MCU.47 70.25,25.25 73.75,21.75 IC4.22
ULPI_DATA3
  Top 0.254: IC4.21 83.75,22.25 81.25,24.75 MCU.69
ULPI_DATA4
  Top 0.254: MCU.70 81.75,25.25 84.25,22.75 IC4.20
ULPI_DATA5  (via drill 0.35)
  Top 0.254: MCU.73 86.75,39.75 v87,39.5 | v89.5,23.5 89.75,23.25 IC4.19
  Bottom 0.254: v87,39.5 87.5,39 87.5,25.5 v89.5,23.5
ULPI_DATA6  (via drill 0.35)
  Top 0.254: MCU.74 87.25,40.25 v87.5,40 | v90,24 90.25,23.75 IC4.18
  Bottom 0.254: v87.5,40 88,39.5 88,26 v90,24
ULPI_DATA7  (via drill 0.35)
  Top 0.254: MCU.135 69.75,46.75 v73.5,43 | v84.5,34.52 v88.52,34.52 | IC4.17 90.75,24.25 v90.5,24.5
  Bottom 0.254: v73.5,43 73.5,35.5 74.43,34.57 84.45,34.57 v84.5,34.52 | v88.52,34.52 88.52,26.48 v90.5,24.5
ULPI_DIR  (via drill 0.35)
  Top 0.254: IC4.12 127.75,32.25 126.5,33.5 83.52,33.5 v83.5,33.52 | v72.02,42.5 70.77,43.75 MCU.28
  Bottom 0.254: v83.5,33.52 83.23,33.52 83.21,33.53 73.47,33.53 72,35 72,42.48 v72.02,42.5
ULPI_NXT  (via drill 0.35)
  Top 0.254: IC4.11 128.25,32.75 127,34 84.02,34 v84,34.02 | v72.52,41 70.27,43.25 MCU.29
  Bottom 0.254: v84,34.02 83.73,34.02 83.7,34.05 73.95,34.05 72.5,35.5 72.5,40.98 v72.52,41
ULPI_STP  (via drill 0.35)
  Top 0.254: IC4.13 127.25,31.75 126,33 83.02,33 v83,33.02 | MCU.26 70.75,44.75 v71.5,44
  Bottom 0.254: v71.5,44 71.5,34.5 72.98,33.02 v83,33.02
USART1_RX  (via drill 0.35)
  Top 0.254: MCU.137 68.75,61.25 v69,61.5 | v140.5,62.5 138.52,64.48 v110,64.48
  Bottom 0.254: v69,61.5 72,64.5 109.98,64.5 v110,64.48 | CON_BACKPLANE.25 141.5,33.67 141.5,61.5 v140.5,62.5
USART1_TX  (via drill 0.35)
  Top 0.254: MCU.136 69.25,60.75 v69.5,61 | v109.5,63.98 109.77,63.98 109.79,63.97 110.21,63.97 110.25,64 138,64 v139.5,62.5
  Bottom 0.254: v69.5,61 72.5,64 109.48,64 v109.5,63.98 | v139.5,62.5 141,61 141,32 149,24 154,24 154.5,24.5 154.5,25.75 CON_BACKPLANE.26
USB_DATA_DM
  Top 0.254: IC4.8 143.25,24.25 151.79,15.71 CON_BACKPLANE.30
USB_DATA_DP
  Top 0.254: IC4.7 141.26,23.75 CON_BACKPLANE.29
VBUS_USB_DATA  (via drill 0.35)
  Top 0.254: R18.2 v141,22
  Bottom 0.254: v141,22 153.17,22 CON_BACKPLANE.28
VCAP  (via drill 0.35)
  Top 0.254: MCU.71 82.25,36.25 v82.5,36 | MCU.106 86.25,56.25 v86.5,56.5
  Bottom 0.254: C30.1 v82.5,36 82.5,36.5 83.5,37.5 83.5,56 84,56.5 v86.5,56.5 C31.1

### Text on the board
tPlace: DIGITAL BACKEND / v1, pd, 2022 | 3 | 1 | SJ1: BOOT SOURCE / 1: USER FLASH / 3: SYSTEM FLASH